# Altium project Apalis Evaluation Board.PrjPCB (part 1 of 5)
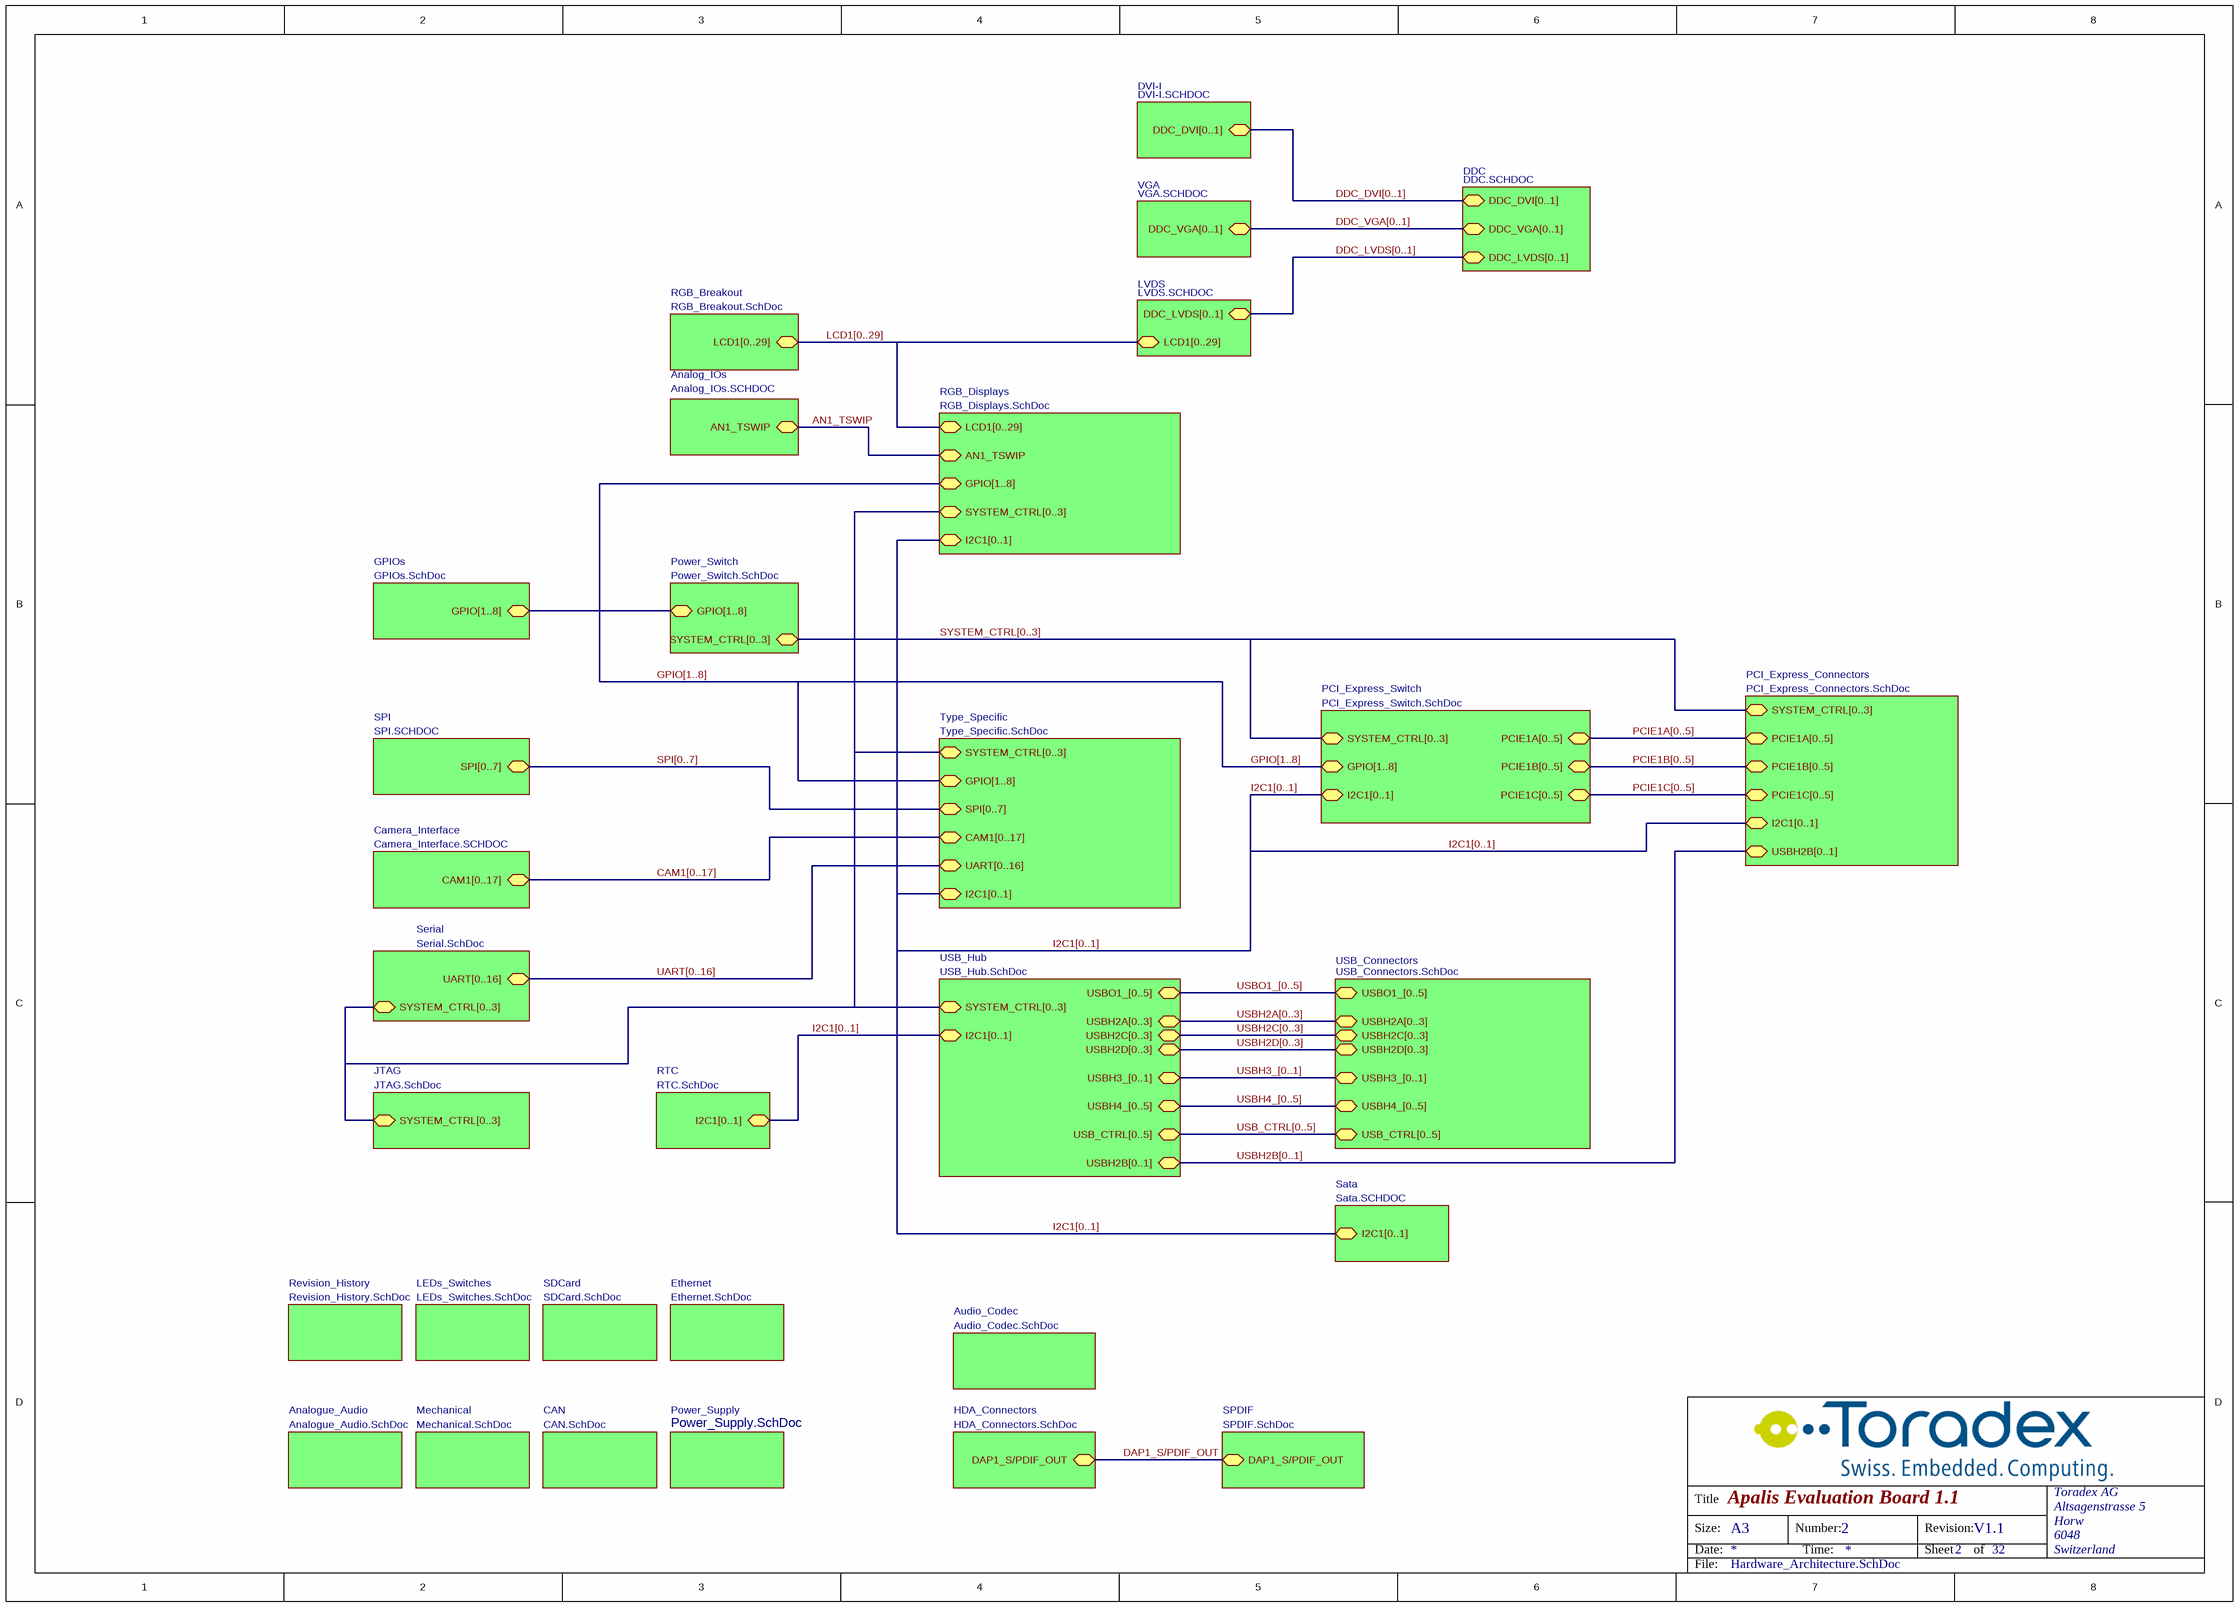
[diagram p0: Hardware_Architecture.SchDoc]
29 sheets, 1036 parts. Net scope: global (net labels, ports and power ports of the same name join across sheets).
Board file: Apalis Evaluation Board.PcbDoc
Sheets:
  Hardware_Architecture.SchDoc
    Analogue_Audio = Analogue_Audio.SchDoc
    Analog_IOs = Analog_IOs.SCHDOC
    Audio_Codec = Audio_Codec.SchDoc
    Camera_Interface = Camera_Interface.SCHDOC
    CAN = CAN.SchDoc
    Ethernet = Ethernet.SchDoc
    GPIOs = GPIOs.SchDoc
    HDA_Connectors = HDA_Connectors.SchDoc
    JTAG = JTAG.SchDoc
    LEDs_Switches = LEDs_Switches.SchDoc
    PCI_Express_Connectors = PCI_Express_Connectors.SchDoc
    PCI_Express_Switch = PCI_Express_Switch.SchDoc
    Power_Supply = Power_Supply.SchDoc
    Power_Switch = Power_Switch.SchDoc
    RGB_Displays = RGB_Displays.SchDoc
    RTC = RTC.SchDoc
    Sata = Sata.SCHDOC
    SPDIF = SPDIF.SchDoc
    SPI = SPI.SCHDOC
    Type_Specific = Type_Specific.SchDoc
    USB_Connectors = USB_Connectors.SchDoc
    USB_Hub = USB_Hub.SchDoc
    Mechanical = Mechanical.SchDoc
    DDC = DDC.SchDoc
    VGA = VGA.SchDoc
    LVDS = LVDS.SchDoc
    DVI-I = DVI-I.SchDoc
    Revision_History = Revision_History.SchDoc

## Sheet Hardware_Architecture.SchDoc: Apalis Evaluation Board 1.1
size A3; Organization: Toradex AG; Address1: Altsagenstrasse 5; Address2: Horw; Address3: 6048; Address4: Switzerland; DocumentNumber: 2; Revision: V1.1; SheetNumber: 2; SheetTotal: 32; PageSetup: Record=PageOptions|CenterHorizontal=True|CenterVertical=True|PrintScale=0.73|XCorrection=1.00|YCorrection=1.00|PrintKind=0|BorderSize=5000000|LeftOffset=0|BottomOffset=0|Orientation=2|PaperLength=1000|PaperWidth=1000|Scale=100|PaperSource=7|PrintQuality=600|MediaType=1|DitherType=10|PaperKind=A4|PrintScaleMode=1

### Sub-sheets
Analog_IOs = Analog_IOs.SCHDOC: AN1_TSWIP (bidir)
Analogue_Audio = Analogue_Audio.SchDoc: no entries
Audio_Codec = Audio_Codec.SchDoc: no entries
Camera_Interface = Camera_Interface.SCHDOC: CAM1[0..17] (bidir)
CAN = CAN.SchDoc: no entries
DDC = DDC.SCHDOC: DDC_VGA[0..1] (bidir), DDC_DVI[0..1] (bidir), DDC_LVDS[0..1] (bidir)
DVI-I = DVI-I.SCHDOC: DDC_DVI[0..1] (bidir)
Ethernet = Ethernet.SchDoc: no entries
GPIOs = GPIOs.SchDoc: GPIO[1..8] (bidir)
HDA_Connectors = HDA_Connectors.SchDoc: DAP1_S/PDIF_OUT (bidir)
JTAG = JTAG.SchDoc: SYSTEM_CTRL[0..3] (bidir)
LEDs_Switches = LEDs_Switches.SchDoc: no entries
LVDS = LVDS.SCHDOC: DDC_LVDS[0..1] (bidir), LCD1[0..29] (bidir)
Mechanical = Mechanical.SchDoc: no entries
PCI_Express_Connectors = PCI_Express_Connectors.SchDoc: PCIE1A[0..5] (bidir), PCIE1B[0..5] (bidir), PCIE1C[0..5] (bidir), I2C1[0..1] (bidir), USBH2B[0..1] (bidir), SYSTEM_CTRL[0..3] (bidir)
PCI_Express_Switch = PCI_Express_Switch.SchDoc: PCIE1A[0..5] (bidir), PCIE1B[0..5] (bidir), PCIE1C[0..5] (bidir), I2C1[0..1] (bidir), SYSTEM_CTRL[0..3] (bidir), GPIO[1..8] (bidir)
Power_Supply = Power_Supply.SchDoc: no entries
Power_Switch = Power_Switch.SchDoc: SYSTEM_CTRL[0..3] (bidir), GPIO[1..8] (bidir)
Revision_History = Revision_History.SchDoc: no entries
RGB_Breakout = RGB_Breakout.SchDoc (file not in this document): LCD1[0..29] (bidir)
RGB_Displays = RGB_Displays.SchDoc: LCD1[0..29] (bidir), AN1_TSWIP (bidir), SYSTEM_CTRL[0..3] (bidir), I2C1[0..1] (bidir), GPIO[1..8] (bidir)
RTC = RTC.SchDoc: I2C1[0..1] (bidir)
Sata = Sata.SCHDOC: I2C1[0..1] (bidir)
SDCard = SDCard.SchDoc (file not in this document): no entries
Serial = Serial.SchDoc (file not in this document): UART[0..16] (bidir), SYSTEM_CTRL[0..3] (bidir)
SPDIF = SPDIF.SchDoc: DAP1_S/PDIF_OUT (bidir)
SPI = SPI.SCHDOC: SPI[0..7] (bidir)
Type_Specific = Type_Specific.SchDoc: GPIO[1..8] (bidir), SPI[0..7] (bidir), SYSTEM_CTRL[0..3] (bidir), I2C1[0..1] (bidir), CAM1[0..17] (bidir), UART[0..16] (bidir)
USB_Connectors = USB_Connectors.SchDoc: USBO1_[0..5] (bidir), USBH4_[0..5] (bidir), USBH2D[0..3] (bidir), USBH2C[0..3] (bidir), USBH3_[0..1] (bidir), USB_CTRL[0..5] (bidir), USBH2A[0..3] (bidir)
USB_Hub = USB_Hub.SchDoc: I2C1[0..1] (bidir), USBH2A[0..3] (bidir), USBH2B[0..1] (bidir), USBH2C[0..3] (bidir), USBH2D[0..3] (bidir), USBO1_[0..5] (bidir), USBH4_[0..5] (bidir), USBH3_[0..1] (bidir), USB_CTRL[0..5] (bidir), SYSTEM_CTRL[0..3] (bidir)
VGA = VGA.SCHDOC: DDC_VGA[0..1] (bidir)

### Nets
AN1_TSWIP: sheet Analog_IOs/AN1_TSWIP, sheet RGB_Displays/AN1_TSWIP
DAP1_S/PDIF_OUT: sheet HDA_Connectors/DAP1_S/PDIF_OUT, sheet SPDIF/DAP1_S/PDIF_OUT

### Buses and harness runs
bus CAM1[0..17] = sheet Camera_Interface/CAM1[0..17] = sheet Type_Specific/CAM1[0..17]
bus DDC_DVI[0..1] = sheet DDC/DDC_DVI[0..1] = sheet DVI-I/DDC_DVI[0..1]
bus DDC_LVDS[0..1] = sheet DDC/DDC_LVDS[0..1] = sheet LVDS/DDC_LVDS[0..1]
bus DDC_VGA[0..1] = sheet DDC/DDC_VGA[0..1] = sheet VGA/DDC_VGA[0..1]
bus GPIO[1..8] = sheet GPIOs/GPIO[1..8] = sheet PCI_Express_Switch/GPIO[1..8] = sheet Power_Switch/GPIO[1..8] = sheet RGB_Displays/GPIO[1..8] = sheet Type_Specific/GPIO[1..8]
bus I2C1[0..1] = sheet PCI_Express_Connectors/I2C1[0..1] = sheet PCI_Express_Switch/I2C1[0..1] = sheet RGB_Displays/I2C1[0..1] = sheet RTC/I2C1[0..1] = sheet Sata/I2C1[0..1] = sheet Type_Specific/I2C1[0..1] = sheet USB_Hub/I2C1[0..1]
bus LCD1[0..29] = sheet LVDS/LCD1[0..29] = sheet RGB_Breakout/LCD1[0..29] = sheet RGB_Displays/LCD1[0..29]
bus PCIE1A[0..5] = sheet PCI_Express_Connectors/PCIE1A[0..5] = sheet PCI_Express_Switch/PCIE1A[0..5]
bus PCIE1B[0..5] = sheet PCI_Express_Connectors/PCIE1B[0..5] = sheet PCI_Express_Switch/PCIE1B[0..5]
bus PCIE1C[0..5] = sheet PCI_Express_Connectors/PCIE1C[0..5] = sheet PCI_Express_Switch/PCIE1C[0..5]
bus SPI[0..7] = sheet SPI/SPI[0..7] = sheet Type_Specific/SPI[0..7]
bus SYSTEM_CTRL[0..3] = sheet JTAG/SYSTEM_CTRL[0..3] = sheet PCI_Express_Connectors/SYSTEM_CTRL[0..3] = sheet PCI_Express_Switch/SYSTEM_CTRL[0..3] = sheet Power_Switch/SYSTEM_CTRL[0..3] = sheet RGB_Displays/SYSTEM_CTRL[0..3] = sheet Serial/SYSTEM_CTRL[0..3] = sheet Type_Specific/SYSTEM_CTRL[0..3] = sheet USB_Hub/SYSTEM_CTRL[0..3]
bus UART[0..16] = sheet Serial/UART[0..16] = sheet Type_Specific/UART[0..16]
bus USB_CTRL[0..5] = sheet USB_Connectors/USB_CTRL[0..5] = sheet USB_Hub/USB_CTRL[0..5]
bus USBH2A[0..3] = sheet USB_Connectors/USBH2A[0..3] = sheet USB_Hub/USBH2A[0..3]
bus USBH2B[0..1] = sheet PCI_Express_Connectors/USBH2B[0..1] = sheet USB_Hub/USBH2B[0..1]
bus USBH2C[0..3] = sheet USB_Connectors/USBH2C[0..3] = sheet USB_Hub/USBH2C[0..3]
bus USBH2D[0..3] = sheet USB_Connectors/USBH2D[0..3] = sheet USB_Hub/USBH2D[0..3]
bus USBH3_[0..1] = sheet USB_Connectors/USBH3_[0..1] = sheet USB_Hub/USBH3_[0..1]
bus USBH4_[0..5] = sheet USB_Connectors/USBH4_[0..5] = sheet USB_Hub/USBH4_[0..5]
bus USBO1_[0..5] = sheet USB_Connectors/USBO1_[0..5] = sheet USB_Hub/USBO1_[0..5]

### Notes on the sheet
- Title
- Size:
- Date:
- A3
- Number:
- Time:
- Revision:
- Sheet
- of
- File:

## Sheet Analogue_Audio.SchDoc: Apalis Evaluation Board 1.1
size A3; Organization: Toradex AG; Address1: Altsagenstrasse 5; Address2: Horw; Address3: 6048; Address4: Switzerland; DocumentNumber: 14; Revision: V1.1; SheetNumber: 14; SheetTotal: 32; PageSetup: Record=PageOptions|CenterHorizontal=True|CenterVertical=True|PrintScale=0.73|XCorrection=1.00|YCorrection=1.00|PrintKind=0|BorderSize=5000000|LeftOffset=0|BottomOffset=0|Orientation=2|PaperLength=1000|PaperWidth=1000|Scale=100|PaperSource=7|PrintQuality=-4|MediaType=1|DitherType=10|PaperKind=A4|PrintScaleMode=1
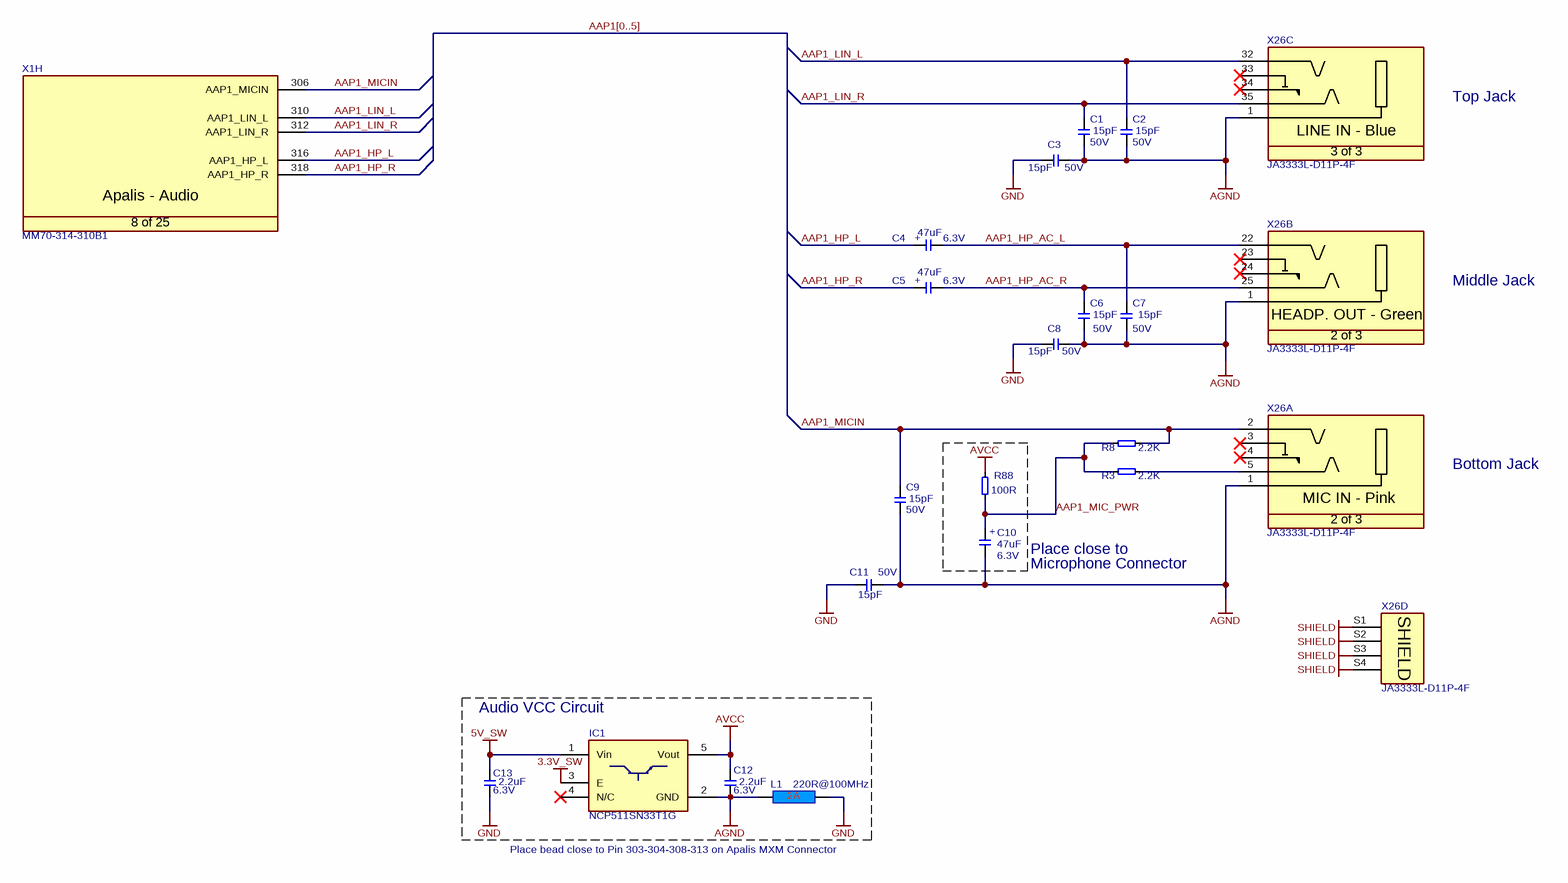
[diagram p1: Analogue_Audio.SchDoc]

### Parts
C1  Rating: 50V  [T_CAPC0603X33N]  (hidden comment: 15pF)
C2  Rating: 50V  [T_CAPC0603X33N]  (hidden comment: 15pF)
C3  Rating: 50V  [T_CAPC0603X33N]  (hidden comment: 15pF)
C4  Rating: 6.3V  [T_CAPMP3216X180N]  (hidden comment: 47uF)
C5  Rating: 6.3V  [T_CAPMP3216X180N]  (hidden comment: 47uF)
C6  Rating: 50V  [T_CAPC0603X33N]  (hidden comment: 15pF)
C7  Rating: 50V  [T_CAPC0603X33N]  (hidden comment: 15pF)
C8  Rating: 50V  [T_CAPC0603X33N]  (hidden comment: 15pF)
C9  Rating: 50V  [T_CAPC0603X33N]  (hidden comment: 15pF)
C10  Rating: 6.3V  [T_CAPMP3216X180N]  (hidden comment: 47uF)
C11  Rating: 50V  [T_CAPC0603X33N]  (hidden comment: 15pF)
C12  Rating: 6.3V  [T_CAPC0603X33N]  (hidden comment: 2.2uF)
C13  Rating: 6.3V  [T_CAPC0603X33N]  (hidden comment: 2.2uF)
IC1  NCP511SN33T1G  [SOT95P279X142-5N]
L1  220R@100MHz  [INDC1608X95N]
R3  2.2K  [T_RESC0603X30N]
R8  2.2K  [T_RESC0603X30N]
R88  100R  [T_RESC0603X30N]
X1  Manufacturer Part No.: MM70-314-310B1  [T_JAE_MM70-314-310B1]  (hidden comment: CON-JAE-MM70-314-310B1-314-0.5mm)  (part H of 25)
X26  JA3333L-D11P-4F  [T_FOXCONN_JA3333L-D11P-4F]  (parts A,B,C,D of 4)

### Blocks framed on the sheet
Audio VCC Circuit: C12 C13 IC1 L1

### Nets
3.3V_SW: IC1.3(E)
5V_SW: C13.2 IC1.1(Vin)
AGND: C1.1 C2.1 C3.2 C6.1 C7.1 C8.2 C9.1 C10.2 C11.1 C12.1 IC1.2(GND) L1.1 X26.1
AVCC: C12.2 IC1.5(Vout) R88.2
GND: C3.1 C8.1 C11.2 C13.1 L1.2
SHIELD: X26.S1(SHIELD) X26.S2(SHIELD) X26.S3(SHIELD) X26.S4(SHIELD)
AAP1_HP_AC_L: C4.2 C7.2 X26.22
AAP1_HP_AC_R: C5.2 C6.2 X26.25
AAP1_HP_L: C4.1 X1.316(AAP1_HP_L)
AAP1_HP_R: C5.1 X1.318(AAP1_HP_R)
AAP1_LIN_L: C2.2 X1.310(AAP1_LIN_L) X26.32
AAP1_LIN_R: C1.2 X1.312(AAP1_LIN_R) X26.35
AAP1_MIC_PWR: C10.1 R3.1 R8.1 R88.1
AAP1_MICIN: C9.2 R8.2 X1.306(AAP1_MICIN) X26.2
NetR3_2: R3.2 X26.5

Not connected (* = marked no-connect by the designer): IC1 4(N/C)*; X26 3* 4* 23* 24* 33* 34*

### Buses and harness runs
bus AAP1[0..5]

### Notes on the sheet
- Top Jack
- Middle Jack
- Bottom Jack
- Place close to
- (near C10) Microphone Connector
- Place bead close to Pin 303-304-308-313 on Apalis MXM Connector
- Title
- Size:
- Date:
- A3
- Number:
- Time:
- Revision:
- Sheet
- of
- File:
- (in symbol C-TA-47uF-6.3V-20%-3216) +
- (in symbol CON-Foxconn-JA3333L-D11P-4F, part A) MIC IN - Pink; 2 of 3
- (in symbol CON-Foxconn-JA3333L-D11P-4F, part B) HEADP. OUT - Green; 2 of 3
- (in symbol CON-Foxconn-JA3333L-D11P-4F, part C) LINE IN - Blue; 3 of 3
- (in symbol CON-JAE-MM70-314-310B1-314-0.5mm, part H) Apalis - Audio; 8 of 25

### Library data of the parts
C1-C3 C6-C9 C11 = C-NPO-15pF-50V-10%-0603: Capacitor Ceramic NPO 15pF 50V 10% 0603; Tolerance: 10%; Type: NPO; Value: 15pF
C4 C5 C10 = C-TA-47uF-6.3V-20%-3216: Capacitor TA 47uF 6.3V 20% 3216; Tolerance: 20%; Type: TA; Value: 47uF
C12 C13 = C-X5R-2.2uF-6.3V-20%-0603: Capacitor Ceramic X5R 2.2uF 6.3V 20% 0603; Tolerance: 20%; Type: X5R; Value: 2.2uF
IC1 = IC-ON-NCP511SN33T1G: NCP511SN33T1G LDO Regulator; Manufacturer Name: ON Semiconductor; Manufacturer Part No.: NCP511SN33T1G
L1 = L-220R@100MHz-2A-25%-0603: 220R@100MHz 2A EMI FILTER; Tolerance: 25%; Rating: 2A; Value: 220R@100MHz
R3 R8 = R-2.2KR-63mW-5%-0603: Resistor 2.2Kohm 63mW 5% 0603; Value: 2.2KR; Rating: 63mW; Tolerance: 5%
R88 = R-100R-63mW-5%-0603: Resistor 100 ohm 63mW 5% 0603; Rating: 63mW; Tolerance: 5%; Value: 100R
X1 = CON-JAE-MM70-314-310B1-314-0.5mm: MXM3 Connector; Manufacturer Name: JAE; No. of ways: 314
X26 = CON-Foxconn-JA3333L-D11P-4F: 3x Audiojack stereo, 3.5mm with sense; No. of ways: 13; Manufacturer Name: Foxconn; Manufacturer Part No.: JA3333L-D11P-4F

## Sheet Analog_IOs.SCHDOC: Apalis Evaluation Board 1.1
size A3; Organization: Toradex AG; Address1: Altsagenstrasse 5; Address2: Horw; Address3: 6048; Address4: Switzerland; DocumentNumber: 15; Revision: V1.1; SheetNumber: 15; SheetTotal: 32; PageSetup: Record=PageOptions|CenterHorizontal=True|CenterVertical=True|PrintScale=0.73|XCorrection=1.00|YCorrection=1.00|PrintKind=0|BorderSize=5000000|LeftOffset=0|BottomOffset=0|Orientation=2|PaperLength=1000|PaperWidth=1000|Scale=100|PaperSource=7|PrintQuality=-4|MediaType=1|DitherType=10|PaperKind=A4|PrintScaleMode=1
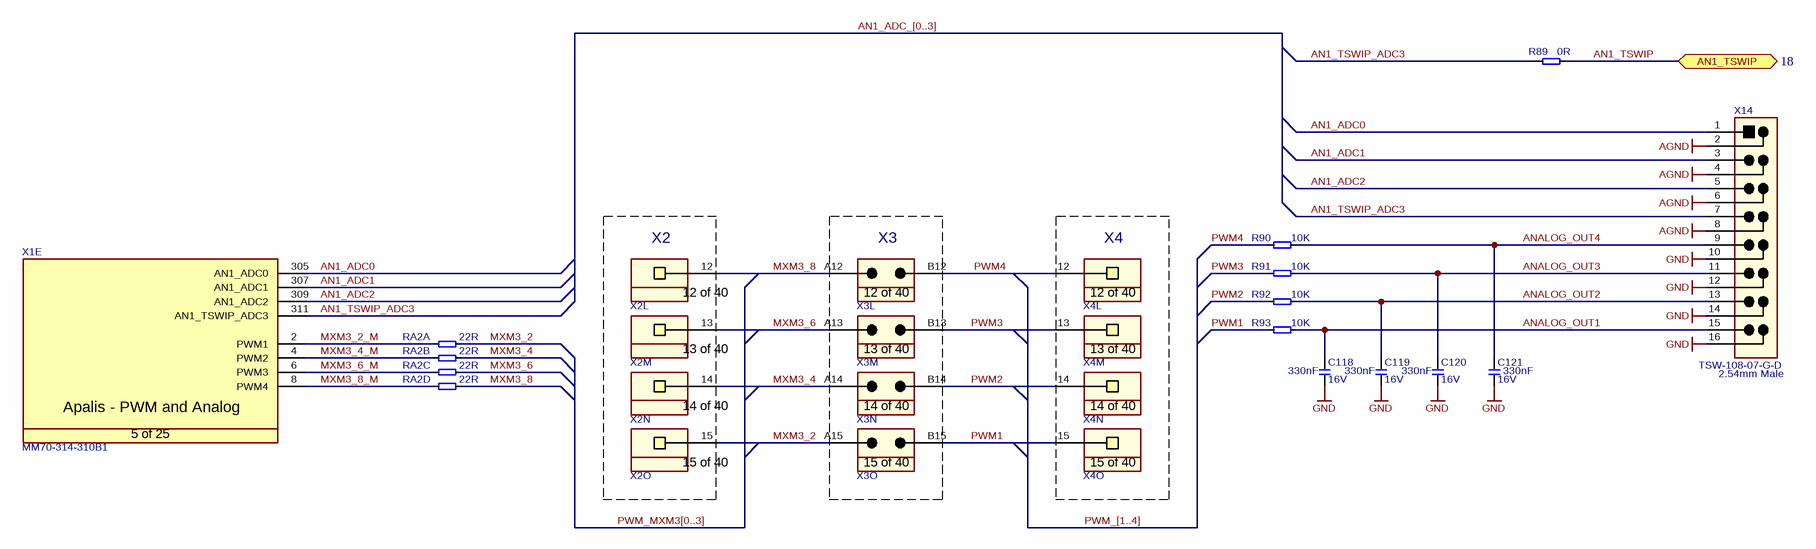
[diagram p2: Analog_IOs.SCHDOC]

### Parts
C118  Rating: 16V  [T_CAPC0805X125N]  (hidden comment: 330nF)
C119  Rating: 16V  [T_CAPC0805X125N]  (hidden comment: 330nF)
C120  Rating: 16V  [T_CAPC0805X125N]  (hidden comment: 330nF)
C121  Rating: 16V  [T_CAPC0805X125N]  (hidden comment: 330nF)
R89  0R  [T_RESC0603X30N]
R90  10K  [T_RESC0603X30N]
R91  10K  [T_RESC0603X30N]
R92  10K  [T_RESC0603X30N]
R93  10K  [T_RESC0603X30N]
RA2  22R  [T_Resistor_Array_X4]  (parts A,B,C,D of 4)
X1  Manufacturer Part No.: MM70-314-310B1  [T_JAE_MM70-314-310B1]  (hidden comment: CON-JAE-MM70-314-310B1-314-0.5mm)  (part E of 25)
X2  SSW-110-01-G-S  [T_Samtec_SSW-110-01-G-S]  (value not drawn)  (parts L,M,N,O of 40)
X3  TSW-110-07-G-D  [T_Samtec_TSW-110-07-G-D]  (value not drawn)  (parts L,M,N,O of 40)
X4  SSW-110-01-G-S  [T_Samtec_SSW-110-01-G-S]  (value not drawn)  (parts L,M,N,O of 40)
X14  TSW-108-07-G-D  [T_Samtec_TSW-108-07-G-D]

### Blocks framed on the sheet
X2: X2
X3: X3
X4: X4

### Ports
AN1_TSWIP (bidir, see 18)

### Nets
AGND: X14.2 X14.4 X14.6 X14.8
GND: C118.1 C119.1 C120.1 C121.1 X14.10 X14.12 X14.14 X14.16
AN1_ADC0: X1.305(AN1_ADC0) X14.1
AN1_ADC1: X1.307(AN1_ADC1) X14.3
AN1_ADC2: X1.309(AN1_ADC2) X14.5
AN1_TSWIP: R89.2 ; port AN1_TSWIP
AN1_TSWIP_ADC3: R89.1 X1.311(AN1_TSWIP_ADC3) X14.7
ANALOG_OUT1: C118.2 R93.2 X14.15
ANALOG_OUT2: C119.2 R92.2 X14.13
ANALOG_OUT3: C120.2 R91.2 X14.11
ANALOG_OUT4: C121.2 R90.2 X14.9
MXM3_2: RA2.1 X2.15 X3.A15
MXM3_2_M: RA2.5 X1.2(PWM1)
MXM3_4: RA2.2 X2.14 X3.A14
MXM3_4_M: RA2.6 X1.4(PWM2)
MXM3_6: RA2.3 X2.13 X3.A13
MXM3_6_M: RA2.7 X1.6(PWM3)
MXM3_8: RA2.4 X2.12 X3.A12
MXM3_8_M: RA2.8 X1.8(PWM4)
PWM1: R93.1 X3.B15 X4.15
PWM2: R92.1 X3.B14 X4.14
PWM3: R91.1 X3.B13 X4.13
PWM4: R90.1 X3.B12 X4.12

### Buses and harness runs
bus AN1_ADC_[0..3]
bus PWM_[1..4]
bus PWM_MXM3[0..3]

### Notes on the sheet
- (near X14) 2.54mm Male
- Title
- Size:
- Date:
- A3
- Number:
- Time:
- Revision:
- Sheet
- of
- File:
- (in symbol CON-JAE-MM70-314-310B1-314-0.5mm, part E) Apalis - PWM and Analog; 5 of 25
- (in symbol CON-Samtec-SSW-110-01-G-S, part L) 12 of 40
- (in symbol CON-Samtec-SSW-110-01-G-S, part M) 13 of 40
- (in symbol CON-Samtec-SSW-110-01-G-S, part N) 14 of 40
- (in symbol CON-Samtec-SSW-110-01-G-S, part O) 15 of 40
- (in symbol CON-Samtec-TSW-110-07-G-D, part L) 12 of 40
- (in symbol CON-Samtec-TSW-110-07-G-D, part M) 13 of 40
- (in symbol CON-Samtec-TSW-110-07-G-D, part N) 14 of 40
- (in symbol CON-Samtec-TSW-110-07-G-D, part O) 15 of 40

### Library data of the parts
C118-C121 = C-X7R-330nF-16V-10%-0805: Capacitor Ceramic X7R 330nF 16V 10% 0805; Tolerance: 10%; Type: X7R; Value: 330nF
R89 = R-0R-63mW-1%-0603: Resistor 0 ohm 63mW 1% 0603; Rating: 63mW; Tolerance: 1%; Value: 0R
R90-R93 = R-10KR-63mW-5%-0603: Resistor 10 Kohm 63mW 5% 0603; Value: 10KR; Rating: 63mW; Tolerance: 5%
RA2 = RA-22R-63mW-5%-1206-div: Resistor Array 22 R 63mW 5% 1206; Tolerance: 5%; Power Dissipation: 63mW; Value: 22R
X1 = CON-JAE-MM70-314-310B1-314-0.5mm: as X1 on sheet Analogue_Audio
X2 X4 = CON-Samtec-SSW-110-01-G-S: Receptacle Female Socket 1x40 pin 2.54mm pitch; Manufacturer Name: Samtec; Pitch: 2.54mm; No. of ways: 1x40; Manufacturer Part No.: SSW-110-01-G-S
X3 = CON-Samtec-TSW-110-07-G-D: Header 2x40 pin 2.54mm pitch; Manufacturer Name: Samtec; Pitch: 2.54mm; No. of ways: 2x40; Manufacturer Part No.: TSW-110-07-G-D
X14 = CON-Samtec-TSW-108-07-G-D: Header Male, 2x8 Pins, 2.54mm pitch; Manufacturer Name: Samtec; No. of ways: 2x8; Pitch: 2.54mm; Manufacturer Part No.: TSW-108-07-G-D

## Sheet Audio_Codec.SchDoc: Apalis Evaluation Board 1.1
size A3; Organization: Toradex AG; Address1: Altsagenstrasse 5; Address2: Horw; Address3: 6048; Address4: Switzerland; DocumentNumber: 11; Revision: V1.1; SheetNumber: 11; SheetTotal: 32; PageSetup: Record=PageOptions|CenterHorizontal=True|CenterVertical=True|PrintScale=0.73|XCorrection=1.00|YCorrection=1.00|PrintKind=0|BorderSize=5000000|LeftOffset=0|BottomOffset=0|Orientation=2|PaperLength=1000|PaperWidth=1000|Scale=100|PaperSource=7|PrintQuality=-4|MediaType=1|DitherType=10|PaperKind=A4|PrintScaleMode=1
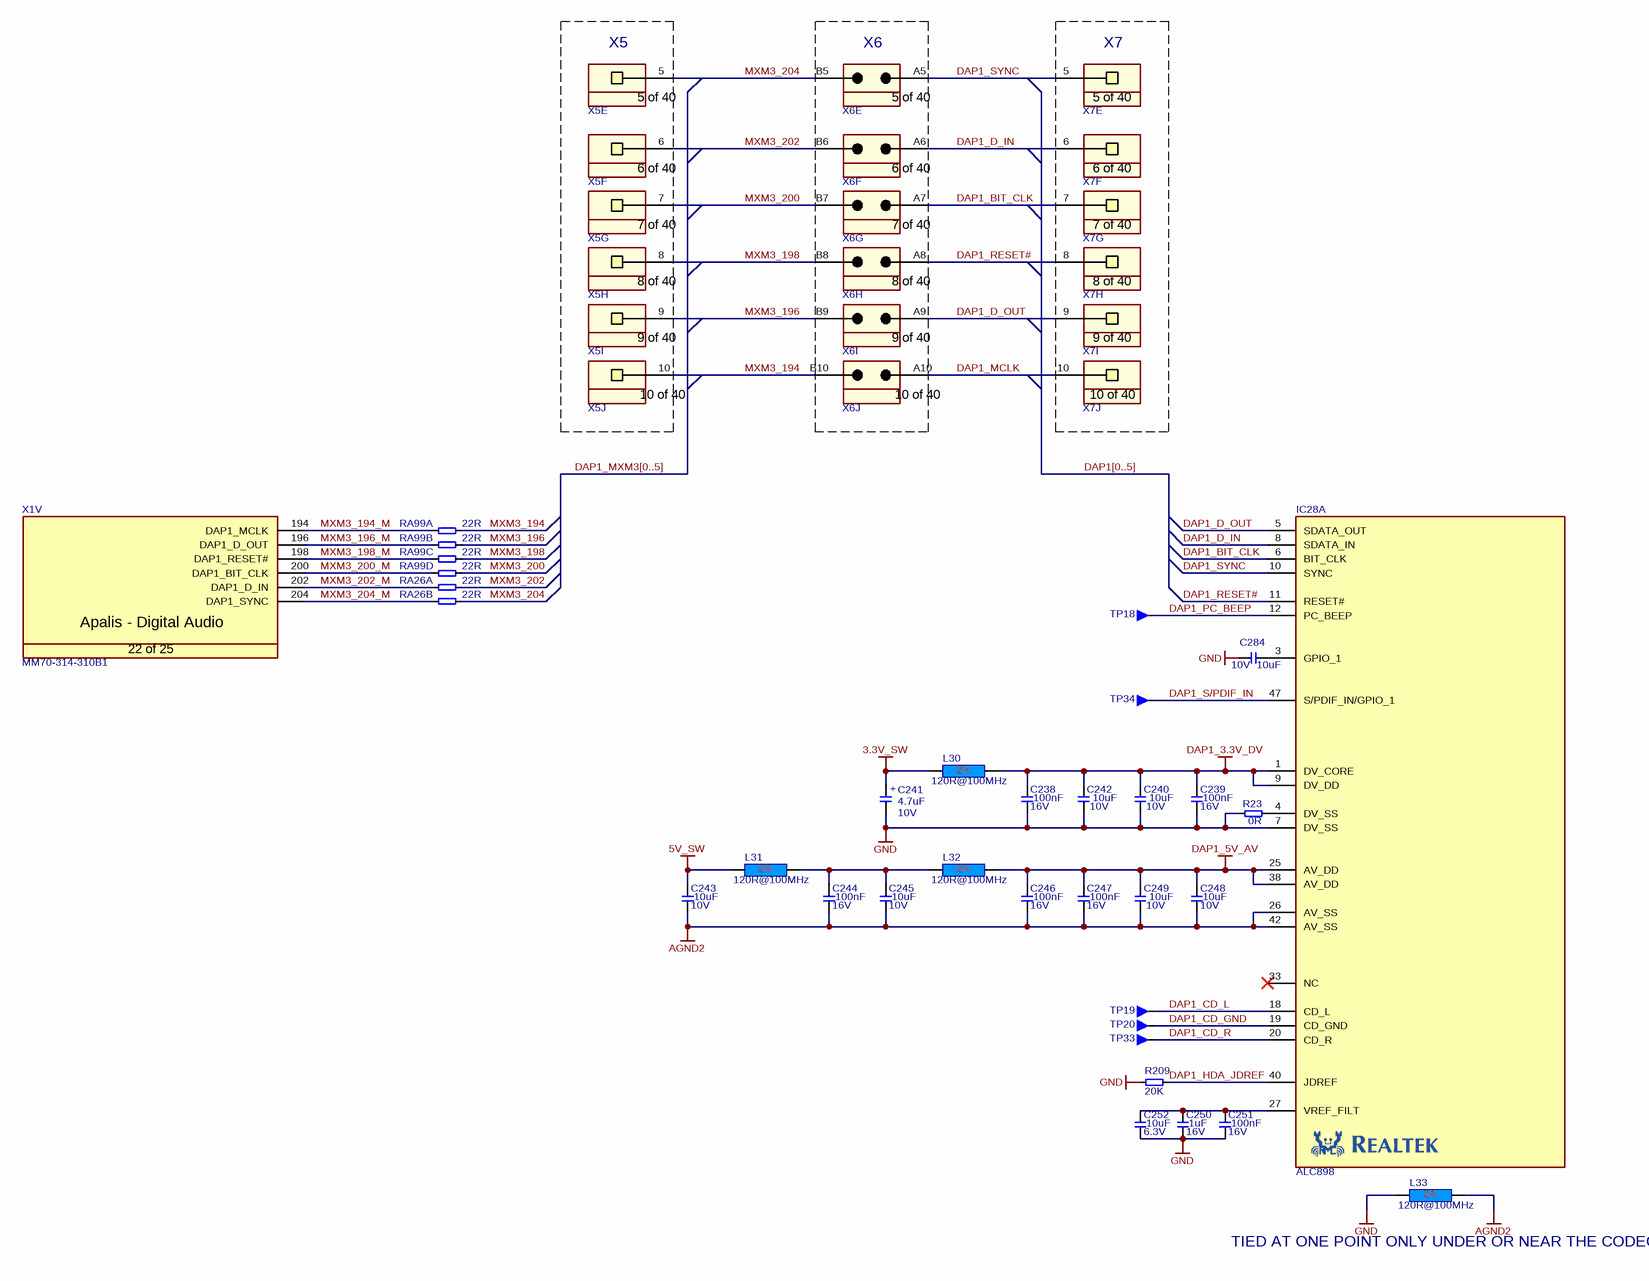
[diagram p3: Audio_Codec.SchDoc]

### Parts
C238  Rating: 16V  [CAPC1005X60N]  (hidden comment: 100nF)
C239  Rating: 16V  [CAPC1005X60N]  (hidden comment: 100nF)
C240  Rating: 10V  [T_CAPC0603X33N]  (hidden comment: 10uF)
C241  Rating: 10V  [T_CAPMP3216X180N]  (hidden comment: 4.7uF)
C242  Rating: 10V  [T_CAPC0603X33N]  (hidden comment: 10uF)
C243  Rating: 10V  [T_CAPC0603X33N]  (hidden comment: 10uF)
C244  Rating: 16V  [CAPC1005X60N]  (hidden comment: 100nF)
C245  Rating: 10V  [T_CAPC0603X33N]  (hidden comment: 10uF)
C246  Rating: 16V  [CAPC1005X60N]  (hidden comment: 100nF)
C247  Rating: 16V  [CAPC1005X60N]  (hidden comment: 100nF)
C248  Rating: 10V  [T_CAPC0603X33N]  (hidden comment: 10uF)
C249  Rating: 10V  [T_CAPC0603X33N]  (hidden comment: 10uF)
C250  Rating: 16V  [CAPC1005X60N]  (hidden comment: 1uF)
C251  Rating: 16V  [CAPC1005X60N]  (hidden comment: 100nF)
C252  Rating: 6.3V  [T_CAPC0603X33N]  (hidden comment: 10uF)
C284  Rating: 10V  [T_CAPC0603X33N]  (hidden comment: 10uF)
IC28  ALC898  [TSQFP50P900X900X160-48N]  (part A of 2)
L30  120R@100MHz  [INDC1608X95N]
L31  120R@100MHz  [INDC1608X95N]
L32  120R@100MHz  [INDC1608X95N]
L33  120R@100MHz  [INDC1608X95N]
R23  0R  [RESC1005X40N]
R209  20K  [T_RESC0603X30N]
RA26  22R  [T_Resistor_Array_X4]  (parts A,B of 4)
RA99  22R  [T_Resistor_Array_X4]  (parts A,B,C,D of 4)
TP18  Testpin  [T_TP-THT]  (value not drawn)
TP19  Testpin  [T_TP-THT]  (value not drawn)
TP20  Testpin  [T_TP-THT]  (value not drawn)
TP33  Testpin  [T_TP-THT]  (value not drawn)
TP34  Testpin  [T_TP-THT]  (value not drawn)
X1  Manufacturer Part No.: MM70-314-310B1  [T_JAE_MM70-314-310B1]  (hidden comment: CON-JAE-MM70-314-310B1-314-0.5mm)  (part V of 25)
X5  SSW-110-01-G-S  [T_Samtec_SSW-110-01-G-S]  (value not drawn)  (parts E,F,G,H,I,J of 40)
X6  TSW-110-07-G-D  [T_Samtec_TSW-110-07-G-D]  (value not drawn)  (parts E,F,G,H,I,J of 40)
X7  SSW-110-01-G-S  [T_Samtec_SSW-110-01-G-S]  (value not drawn)  (parts E,F,G,H,I,J of 40)

### Blocks framed on the sheet
X5: X5
X6: X6
X7: X7

### Nets
3.3V_SW: C241.1 L30.1
5V_SW: C243.2 L31.1
AGND2: C243.1 C244.1 C245.1 C246.1 C247.1 C248.1 C249.1 IC28.26(AV_SS) IC28.42(AV_SS) L33.2
DAP1_3.3V_DV: C238.2 C239.2 C240.2 C242.2 IC28.1(DV_CORE) IC28.9(DV_DD) L30.2
DAP1_5V_AV: C246.2 C247.2 C248.2 C249.2 IC28.25(AV_DD) IC28.38(AV_DD) L32.2
GND: C238.1 C239.1 C240.1 C241.2 C242.1 C250.1 C251.1 C252.1 C284.2 IC28.7(DV_SS) L33.1 R23.1 R209.1
DAP1_BIT_CLK: IC28.6(BIT_CLK) X6.A7 X7.7
DAP1_CD_GND: IC28.19(CD_GND) TP20.1
DAP1_CD_L: IC28.18(CD_L) TP19.1
DAP1_CD_R: IC28.20(CD_R) TP33.1
DAP1_D_IN: IC28.8(SDATA_IN) X6.A6 X7.6
DAP1_D_OUT: IC28.5(SDATA_OUT) X6.A9 X7.9
DAP1_HDA_JDREF: IC28.40(JDREF) R209.2
DAP1_MCLK: X6.A10 X7.10
DAP1_PC_BEEP: IC28.12(PC_BEEP) TP18.1
DAP1_RESET#: IC28.11(RESET#) X6.A8 X7.8
DAP1_S/PDIF_IN: IC28.47(S/PDIF_IN/GPIO_1) TP34.1
DAP1_SYNC: IC28.10(SYNC) X6.A5 X7.5
MXM3_194: RA99.5 X5.10 X6.B10
MXM3_194_M: RA99.1 X1.194(DAP1_MCLK)
MXM3_196: RA99.6 X5.9 X6.B9
MXM3_196_M: RA99.2 X1.196(DAP1_D_OUT)
MXM3_198: RA99.7 X5.8 X6.B8
MXM3_198_M: RA99.3 X1.198(DAP1_RESET#)
MXM3_200: RA99.8 X5.7 X6.B7
MXM3_200_M: RA99.4 X1.200(DAP1_BIT_CLK)
MXM3_202: RA26.5 X5.6 X6.B6
MXM3_202_M: RA26.1 X1.202(DAP1_D_IN)
MXM3_204: RA26.6 X5.5 X6.B5
MXM3_204_M: RA26.2 X1.204(DAP1_SYNC)
NetC244_2: C244.2 C245.2 L31.2 L32.1
NetC250_2: C250.2 C251.2 C252.2 IC28.27(VREF_FILT)
NetC284_1: C284.1 IC28.3(GPIO_1)
NetIC28_4: IC28.4(DV_SS) R23.2

Not connected (* = marked no-connect by the designer): IC28 33(NC)*

### Buses and harness runs
bus DAP1[0..5]
bus DAP1_MXM3[0..5]

### Notes on the sheet
- (near L33) TIED AT ONE POINT ONLY UNDER OR NEAR THE CODEC
- Title
- Size:
- Date:
- A3
- Number:
- Time:
- Revision:
- Sheet
- of
- File:
- (in symbol C-TA-4.7uF-10V-20%-3216) +
- (in symbol CON-JAE-MM70-314-310B1-314-0.5mm, part V) Apalis - Digital Audio; 22 of 25
- (in symbol CON-Samtec-SSW-110-01-G-S, part E) 5 of 40
- (in symbol CON-Samtec-SSW-110-01-G-S, part F) 6 of 40
- (in symbol CON-Samtec-SSW-110-01-G-S, part G) 7 of 40
- (in symbol CON-Samtec-SSW-110-01-G-S, part H) 8 of 40
- (in symbol CON-Samtec-SSW-110-01-G-S, part I) 9 of 40
- (in symbol CON-Samtec-SSW-110-01-G-S, part J) 10 of 40
- (in symbol CON-Samtec-TSW-110-07-G-D, part E) 5 of 40
- (in symbol CON-Samtec-TSW-110-07-G-D, part F) 6 of 40
- (in symbol CON-Samtec-TSW-110-07-G-D, part G) 7 of 40
- (in symbol CON-Samtec-TSW-110-07-G-D, part H) 8 of 40
- (in symbol CON-Samtec-TSW-110-07-G-D, part I) 9 of 40
- (in symbol CON-Samtec-TSW-110-07-G-D, part J) 10 of 40

### Library data of the parts
C238 C239 C244 C246 C247 C251 = C-X7R-100nF-16V-10%-0402: Capacitor Ceramic X7R 100nF 16V 10% 0402; Tolerance: 10%; Type: X7R; Value: 100nF
C240 C242 C243 C245 C248 C249 C284 = C-X5R-10uF-10V-20%-0603: Capacitor Ceramic X5R 10uF 10V 20% 0603; Tolerance: 20%; Type: X5R; Value: 10uF
C241 = C-TA-4.7uF-10V-20%-3216: Capacitor TA 4.7uF 10V 20% 3216; Tolerance: 20%; Type: TA; Value: 4.7uF
C250 = C-X5R-1uF-16V-10%-0402: Capacitor Ceramic X5R 1uF 16V 10% 0402; Tolerance: 10%; Type: X5R; Value: 1uF
C252 = C-X5R-10uF-6.3V-20%-0603: Capacitor Ceramic X5R 10uF 6.3V 20% 0603; Tolerance: 20%; Type: X5R; Value: 10uF
IC28 = IC-Realtek-ALC898: HD_AUDIO_CODEC; Manufacturer Part No.: ALC898; Manufacturer Name: Realtek
L30-L33 = L-120R@100MHz-2A-25%-0603: 120R@100MHz 2A EMI FILTER; Tolerance: 25%; Rating: 2A; Value: 120R@100MHz
R23 = R-0R-63mW-1%-0402: Resistor 0 ohm 63mW 1% 0402; Rating: 63mW; Tolerance: 1%; Value: 0R
R209 = R-20KR-63mW-1%-0603: Resistor 20 Kohm 63mW 1% 0603; Value: 20KR; Rating: 63mW; Tolerance: 1%
RA26 RA99 = RA-22R-63mW-5%-1206-div: Resistor Array 22 R 63mW 5% 1206; Tolerance: 5%; Power Dissipation: 63mW; Value: 22R
TP18-TP20 TP33 TP34 = Testpin: Testpin TH
X1 = CON-JAE-MM70-314-310B1-314-0.5mm: as X1 on sheet Analogue_Audio
X5 X7 = CON-Samtec-SSW-110-01-G-S: as X2 on sheet Analog_IOs; Pitch: 2.54mm; No. of ways: 1x40; Manufacturer Part No.: SSW-110-01-G-S
X6 = CON-Samtec-TSW-110-07-G-D: as X3 on sheet Analog_IOs; Pitch: 2.54mm; No. of ways: 2x40; Manufacturer Part No.: TSW-110-07-G-D

## Sheet Camera_Interface.SCHDOC: Apalis Evaluation Board 1.1
size A3; Organization: Toradex AG; Address1: Altsagenstrasse 5; Address2: Horw; Address3: 6048; Address4: Switzerland; DocumentNumber: 16; Revision: V1.1; SheetNumber: 16; SheetTotal: 32; PageSetup: Record=PageOptions|CenterHorizontal=True|CenterVertical=True|PrintScale=0.73|XCorrection=1.00|YCorrection=1.00|PrintKind=0|BorderSize=5000000|LeftOffset=0|BottomOffset=0|Orientation=2|PaperLength=1000|PaperWidth=1000|Scale=100|PaperSource=7|PrintQuality=-4|MediaType=1|DitherType=10|PaperKind=A4|PrintScaleMode=1
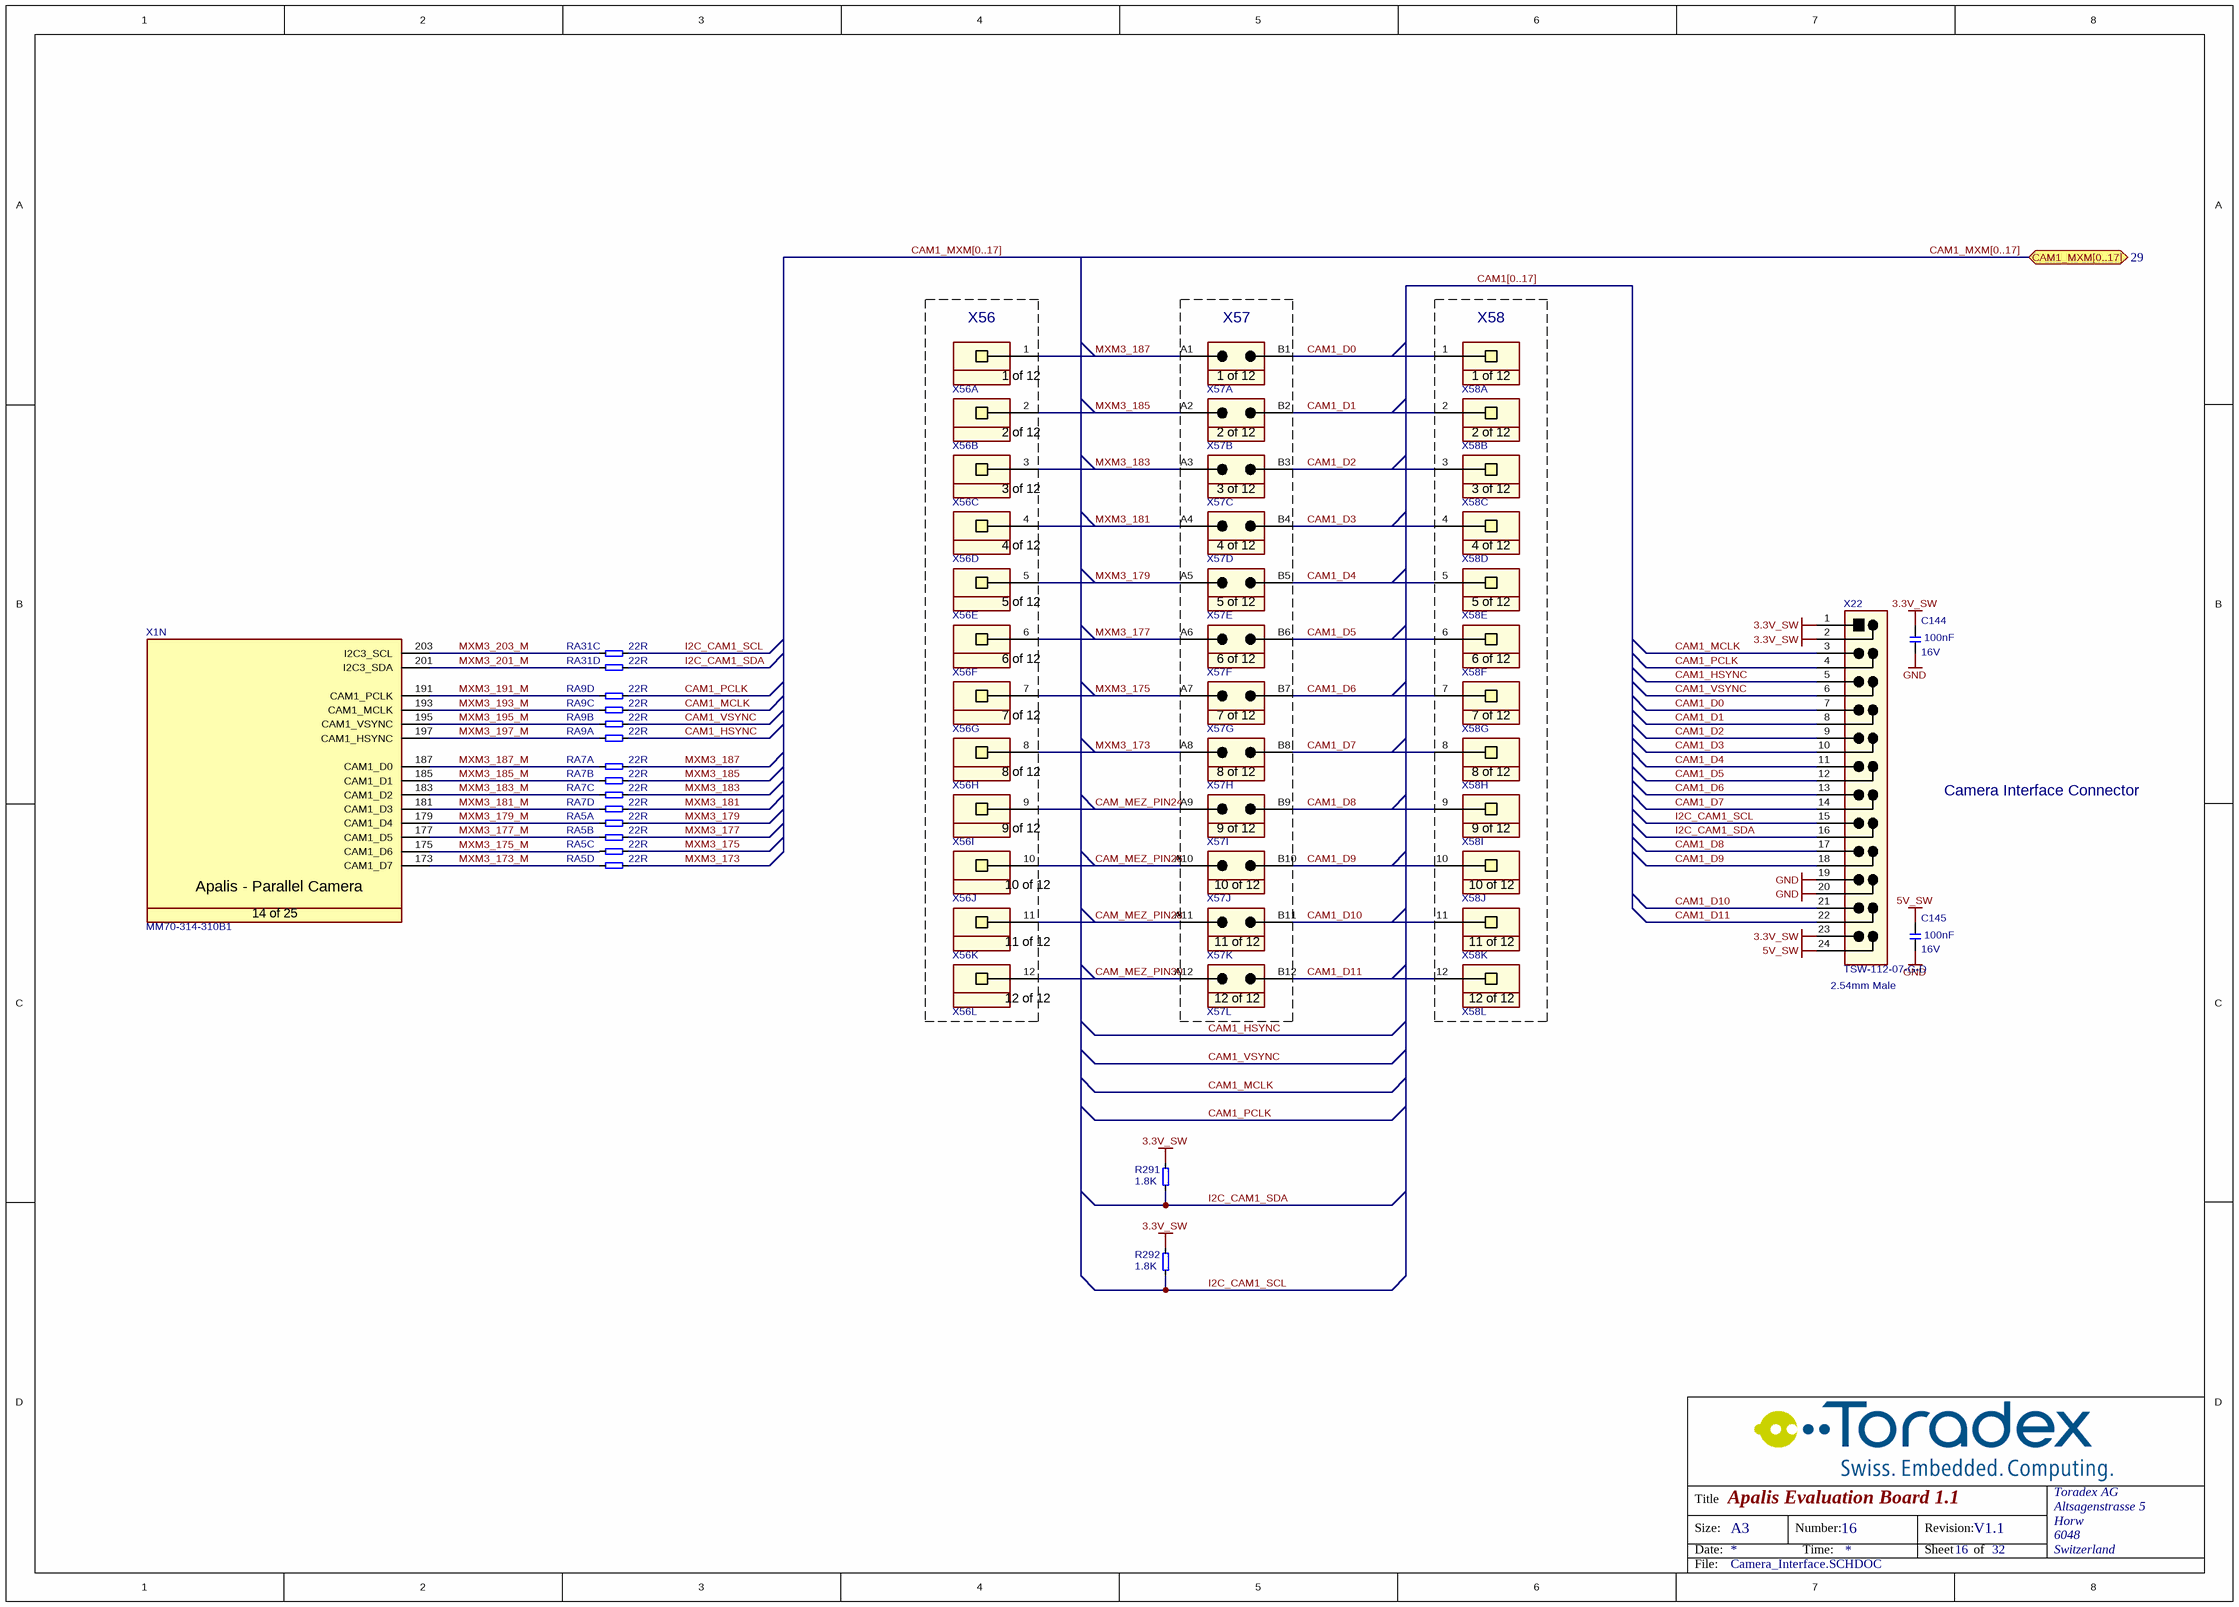
[diagram p4: Camera_Interface.SCHDOC]

### Parts
C144  Rating: 16V  [T_CAPC0603X33N]  (hidden comment: 100nF)
C145  Rating: 16V  [T_CAPC0603X33N]  (hidden comment: 100nF)
R291  1.8K  [T_RESC0603X30N]
R292  1.8K  [T_RESC0603X30N]
RA5  22R  [T_Resistor_Array_X4]  (parts A,B,C,D of 4)
RA7  22R  [T_Resistor_Array_X4]  (parts A,B,C,D of 4)
RA9  22R  [T_Resistor_Array_X4]  (parts A,B,C,D of 4)
RA31  22R  [T_Resistor_Array_X4]  (parts C,D of 4)
X1  Manufacturer Part No.: MM70-314-310B1  [T_JAE_MM70-314-310B1]  (hidden comment: CON-JAE-MM70-314-310B1-314-0.5mm)  (part N of 25)
X22  TSW-112-07-G-D  [T_Samtec_TSW-112-07-G-D-HEADER]
X56  SSW-112-01-G-S  [T_Samtec_SSW-112-01-G-S]  (value not drawn)  (parts A,B,C,D,E,F,G,H,I,J,K,L of 12)
X57  TSW-112-07-G-D  [T_Samtec_TSW-112-07-G-D]  (value not drawn)  (parts A,B,C,D,E,F,G,H,I,J,K,L of 12)
X58  SSW-112-01-G-S  [T_Samtec_SSW-112-01-G-S]  (value not drawn)  (parts A,B,C,D,E,F,G,H,I,J,K,L of 12)

### Blocks framed on the sheet
X56: X56
X57: X57
X58: X58

### Ports
CAM1_MXM[0..17] (bidir, see 29)

### Nets
3.3V_SW: C144.2 R291.1 R292.1 X22.1 X22.2 X22.23
5V_SW: C145.2 X22.24
GND: C144.1 C145.1 X22.19 X22.20
CAM1_D0: X22.7 X57.B1 X58.1
CAM1_D1: X22.8 X57.B2 X58.2
CAM1_D2: X22.9 X57.B3 X58.3
CAM1_D3: X22.10 X57.B4 X58.4
CAM1_D4: X22.11 X57.B5 X58.5
CAM1_D5: X22.12 X57.B6 X58.6
CAM1_D6: X22.13 X57.B7 X58.7
CAM1_D7: X22.14 X57.B8 X58.8
CAM1_D8: X22.17 X57.B9 X58.9
CAM1_D9: X22.18 X57.B10 X58.10
CAM1_D10: X22.21 X57.B11 X58.11
CAM1_D11: X22.22 X57.B12 X58.12
CAM1_HSYNC: RA9.5 X22.5
CAM1_MCLK: RA9.7 X22.3
CAM1_PCLK: RA9.8 X22.4
CAM1_VSYNC: RA9.6 X22.6
CAM_MEZ_PIN24: X56.9 X57.A9
CAM_MEZ_PIN26: X56.10 X57.A10
CAM_MEZ_PIN28: X56.11 X57.A11
CAM_MEZ_PIN30: X56.12 X57.A12
I2C_CAM1_SCL: R292.2 RA31.7 X22.15
I2C_CAM1_SDA: R291.2 RA31.8 X22.16
MXM3_173: RA5.8 X56.8 X57.A8
MXM3_173_M: RA5.4 X1.173(CAM1_D7)
MXM3_175: RA5.7 X56.7 X57.A7
MXM3_175_M: RA5.3 X1.175(CAM1_D6)
MXM3_177: RA5.6 X56.6 X57.A6
MXM3_177_M: RA5.2 X1.177(CAM1_D5)
MXM3_179: RA5.5 X56.5 X57.A5
MXM3_179_M: RA5.1 X1.179(CAM1_D4)
MXM3_181: RA7.8 X56.4 X57.A4
MXM3_181_M: RA7.4 X1.181(CAM1_D3)
MXM3_183: RA7.7 X56.3 X57.A3
MXM3_183_M: RA7.3 X1.183(CAM1_D2)
MXM3_185: RA7.6 X56.2 X57.A2
MXM3_185_M: RA7.2 X1.185(CAM1_D1)
MXM3_187: RA7.5 X56.1 X57.A1
MXM3_187_M: RA7.1 X1.187(CAM1_D0)
MXM3_191_M: RA9.4 X1.191(CAM1_PCLK)
MXM3_193_M: RA9.3 X1.193(CAM1_MCLK)
MXM3_195_M: RA9.2 X1.195(CAM1_VSYNC)
MXM3_197_M: RA9.1 X1.197(CAM1_HSYNC)
MXM3_201_M: RA31.4 X1.201(I2C3_SDA)
MXM3_203_M: RA31.3 X1.203(I2C3_SCL)

### Buses and harness runs
bus CAM1[0..17]
bus CAM1_MXM[0..17] = port CAM1_MXM[0..17]

### Notes on the sheet
- Camera Interface Connector
- (near X22) 2.54mm Male
- Title
- Size:
- Date:
- A3
- Number:
- Time:
- Revision:
- Sheet
- of
- File:
- (in symbol CON-JAE-MM70-314-310B1-314-0.5mm, part N) Apalis - Parallel Camera; 14 of 25
- (in symbol CON-Samtec-SSW-112-01-G-S, part A) 1 of 12
- (in symbol CON-Samtec-SSW-112-01-G-S, part B) 2 of 12
- (in symbol CON-Samtec-SSW-112-01-G-S, part C) 3 of 12
- (in symbol CON-Samtec-SSW-112-01-G-S, part D) 4 of 12
- (in symbol CON-Samtec-SSW-112-01-G-S, part E) 5 of 12
- (in symbol CON-Samtec-SSW-112-01-G-S, part F) 6 of 12
- (in symbol CON-Samtec-SSW-112-01-G-S, part G) 7 of 12
- (in symbol CON-Samtec-SSW-112-01-G-S, part H) 8 of 12
- (in symbol CON-Samtec-SSW-112-01-G-S, part I) 9 of 12
- (in symbol CON-Samtec-SSW-112-01-G-S, part J) 10 of 12
- (in symbol CON-Samtec-SSW-112-01-G-S, part K) 11 of 12
- (in symbol CON-Samtec-SSW-112-01-G-S, part L) 12 of 12
- (in symbol CON-Samtec-TSW-112-07-G-D, part A) 1 of 12
- (in symbol CON-Samtec-TSW-112-07-G-D, part B) 2 of 12
- (in symbol CON-Samtec-TSW-112-07-G-D, part C) 3 of 12
- (in symbol CON-Samtec-TSW-112-07-G-D, part D) 4 of 12
- (in symbol CON-Samtec-TSW-112-07-G-D, part E) 5 of 12
- (in symbol CON-Samtec-TSW-112-07-G-D, part F) 6 of 12
- (in symbol CON-Samtec-TSW-112-07-G-D, part G) 7 of 12
- (in symbol CON-Samtec-TSW-112-07-G-D, part H) 8 of 12
- (in symbol CON-Samtec-TSW-112-07-G-D, part I) 9 of 12
- (in symbol CON-Samtec-TSW-112-07-G-D, part J) 10 of 12
- (in symbol CON-Samtec-TSW-112-07-G-D, part K) 11 of 12
- (in symbol CON-Samtec-TSW-112-07-G-D, part L) 12 of 12

### Library data of the parts
C144 C145 = C-X7R-100nF-16V-10%-0603: Capacitor Ceramic X7R 100nF 16V 10% 0603; Tolerance: 10%; Type: X7R; Value: 100nF
R291 R292 = R-1.8KR-63mW-5%-0603: Resistor 1.8 Kohm 63mW 5% 0603; Value: 1.8KR; Rating: 63mW; Tolerance: 5%
RA5 RA7 RA9 RA31 = RA-22R-63mW-5%-1206-div: Resistor Array 22 R 63mW 5% 1206; Tolerance: 5%; Power Dissipation: 63mW
  RA5 RA7 RA31: Value: 22R
X1 = CON-JAE-MM70-314-310B1-314-0.5mm: as X1 on sheet Analogue_Audio
X22 = CON-Samtec-TSW-112-07-G-D-Header: Header male, 2x12 Pins, 2.54 mm pitch; Manufacturer Name: Samtec; Pitch: 2.54 mm; No. of ways: 2x12; Manufacturer Part No.: TSW-112-07-G-D
X56 X58 = CON-Samtec-SSW-112-01-G-S: Header 1x12 pin 2.54mm pitch; Manufacturer Name: Samtec; Pitch: 2.54mm; No. of ways: 1x12; Manufacturer Part No.: SSW-112-01-G-S
X57 = CON-Samtec-TSW-112-07-G-D: Header 2x12 pin 2.54mm pitch; Manufacturer Name: Samtec; Pitch: 2.54mm; No. of ways: 2x12; Manufacturer Part No.: TSW-112-07-G-D

## Sheet CAN.SchDoc: Apalis Evaluation Board 1.1
size A3; Organization: Toradex AG; Address1: Altsagenstrasse 5; Address2: Horw; Address3: 6048; Address4: Switzerland; DocumentNumber: 23; Revision: V1.1; SheetNumber: 23; SheetTotal: 32; PageSetup: Record=PageOptions|CenterHorizontal=True|CenterVertical=True|PrintScale=0.73|XCorrection=1.00|YCorrection=1.00|PrintKind=0|BorderSize=5000000|LeftOffset=0|BottomOffset=0|Orientation=2|PaperLength=1000|PaperWidth=1000|Scale=100|PaperSource=7|PrintQuality=-4|MediaType=1|DitherType=10|PaperKind=A4|PrintScaleMode=1
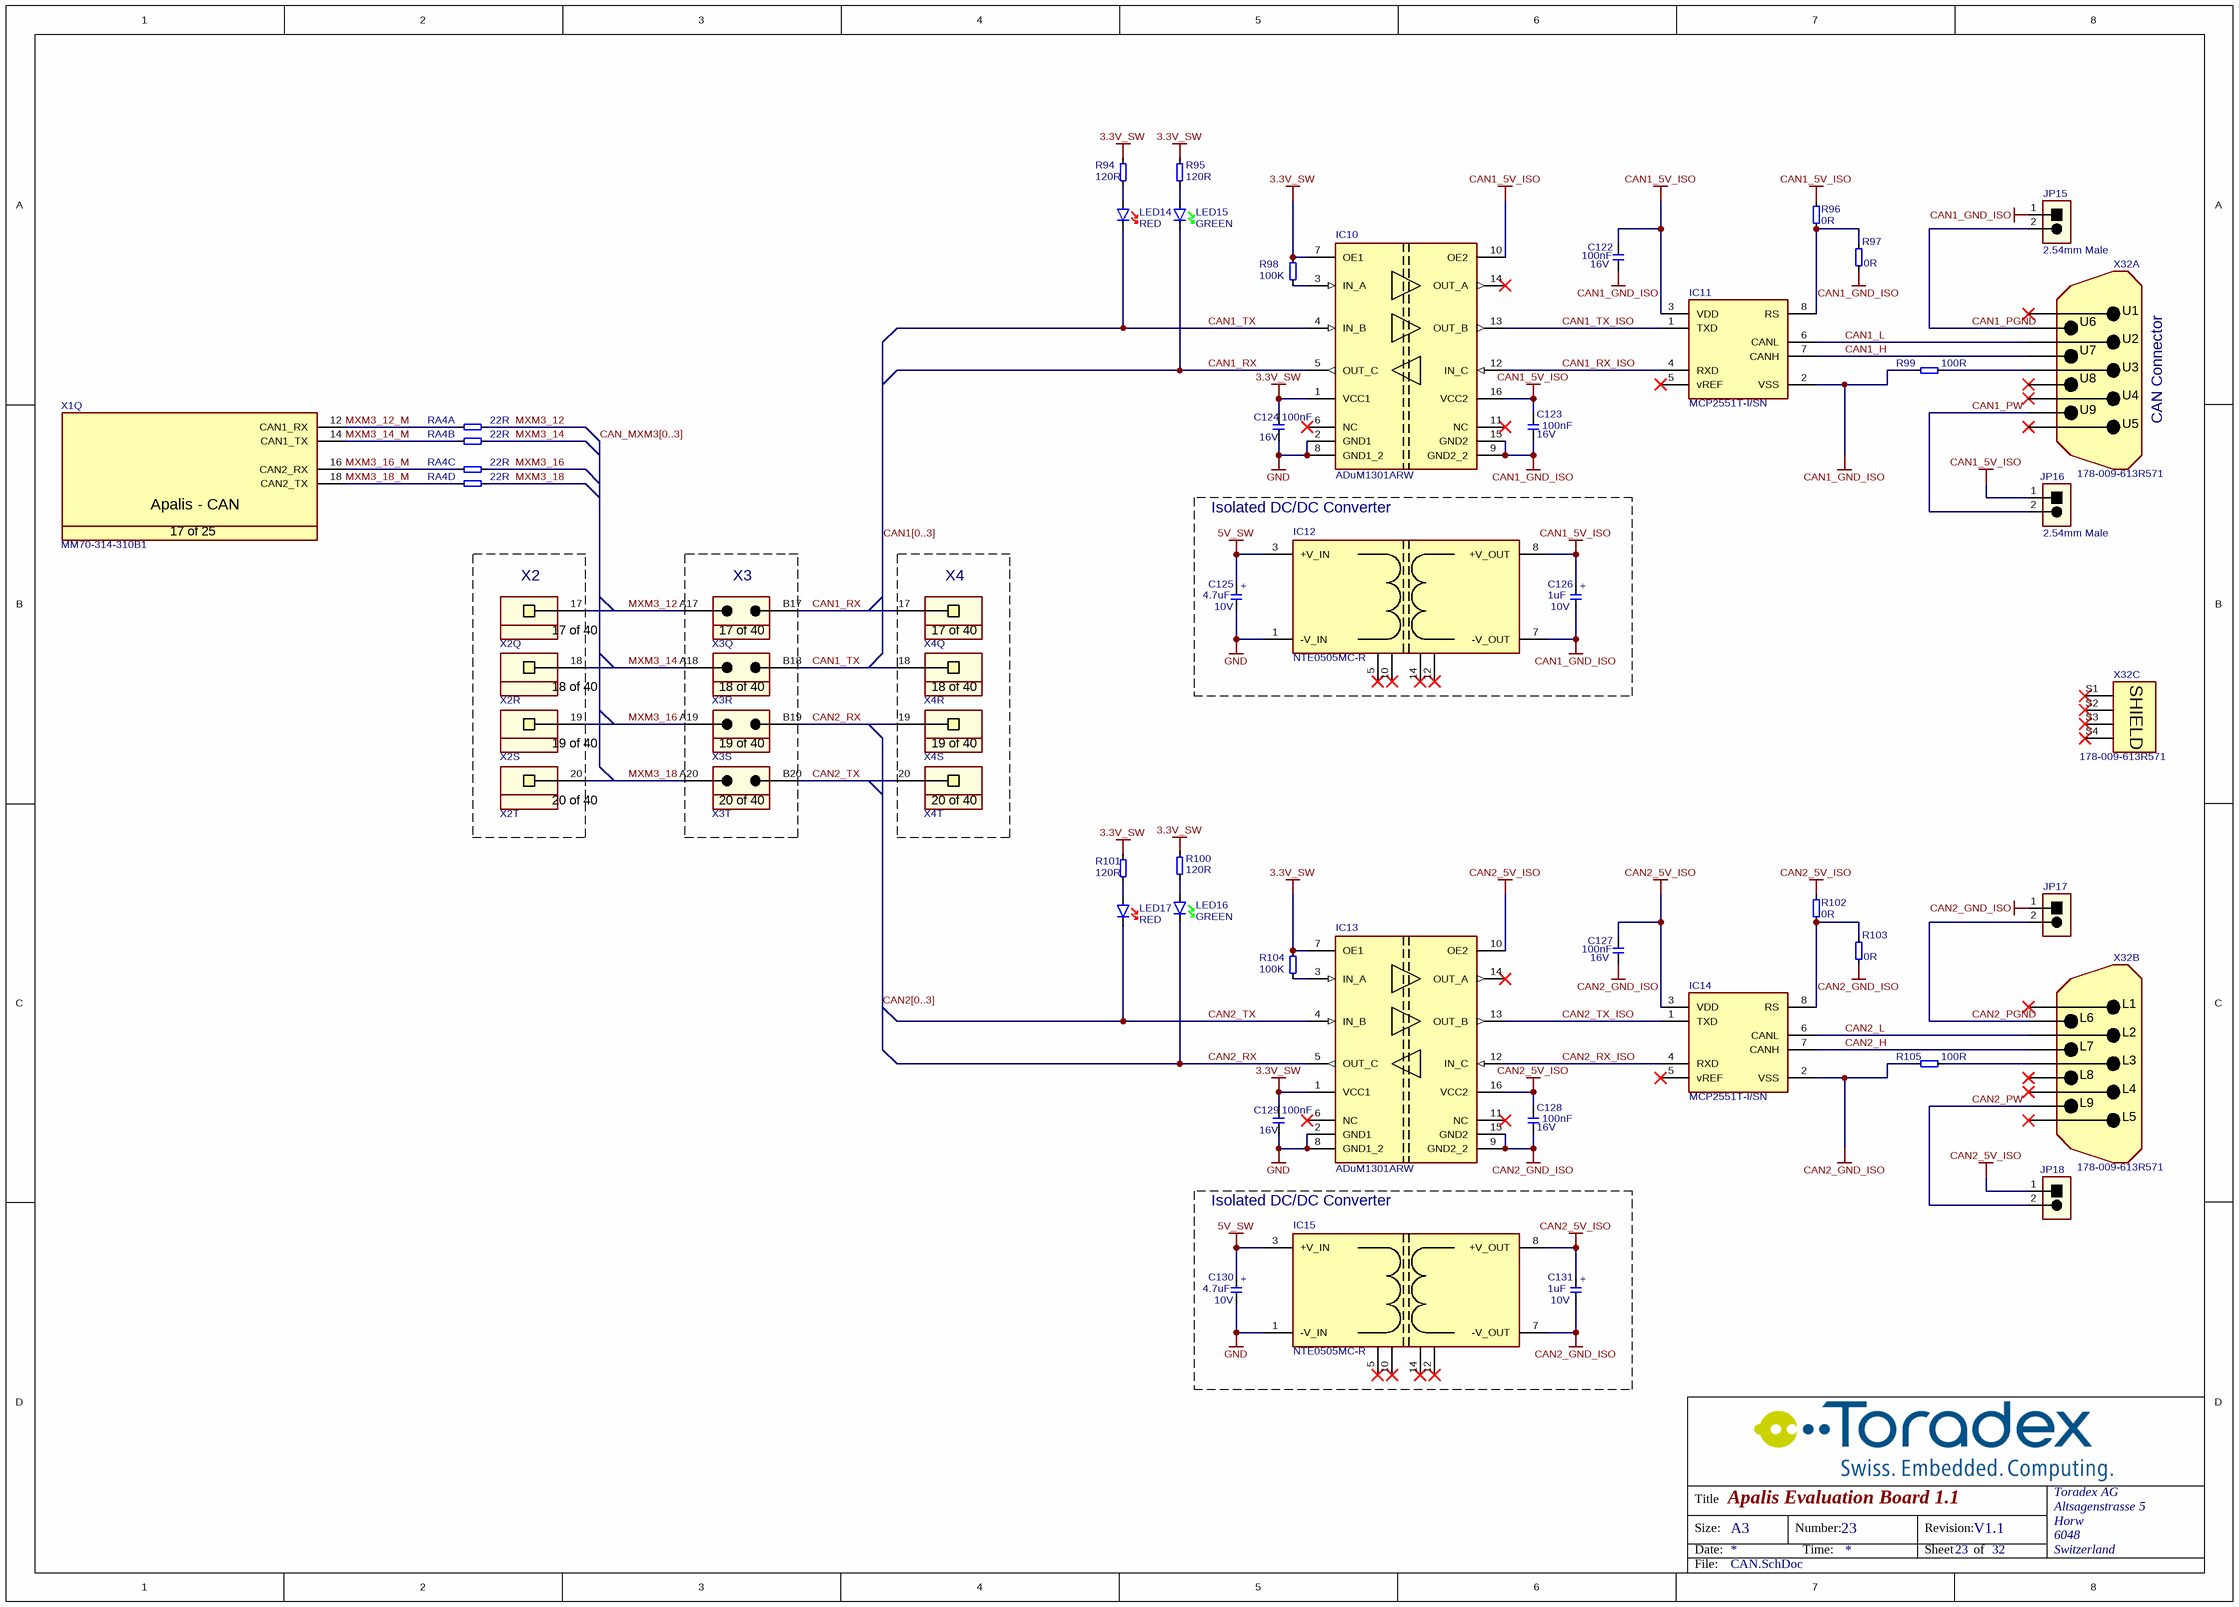
[diagram p5: CAN.SchDoc]

### Parts
C122  Rating: 16V  [T_CAPC0603X33N]  (hidden comment: 100nF)
C123  Rating: 16V  [T_CAPC0603X33N]  (hidden comment: 100nF)
C124  Rating: 16V  [T_CAPC0603X33N]  (hidden comment: 100nF)
C125  Rating: 10V  [T_CAPMP3216X180N]  (hidden comment: 4.7uF)
C126  Rating: 10V  [T_CAPMP3216X180N]  (hidden comment: 1uF)
C127  Rating: 16V  [T_CAPC0603X33N]  (hidden comment: 100nF)
C128  Rating: 16V  [T_CAPC0603X33N]  (hidden comment: 100nF)
C129  Rating: 16V  [T_CAPC0603X33N]  (hidden comment: 100nF)
C130  Rating: 10V  [T_CAPMP3216X180N]  (hidden comment: 4.7uF)
C131  Rating: 10V  [T_CAPMP3216X180N]  (hidden comment: 1uF)
IC10  ADuM1301ARW  [T_AD_ADuM1300ARW]
IC11  MCP2551T-I/SN  [SOIC127P600X173-8N]
IC12  NTE0505MC-R  [T_MURATA_NTE0505MC-R]
IC13  ADuM1301ARW  [T_AD_ADuM1300ARW]
IC14  MCP2551T-I/SN  [SOIC127P600X173-8N]
IC15  NTE0505MC-R  [T_MURATA_NTE0505MC-R]
JP15  TSW-101-07-G-D  [T_Samtec_TSW-101-07-G-D]  (value not drawn)
JP16  TSW-101-07-G-D  [T_Samtec_TSW-101-07-G-D]  (value not drawn)
JP17  TSW-101-07-G-D  [T_Samtec_TSW-101-07-G-D]  (value not drawn)
JP18  TSW-101-07-G-D  [T_Samtec_TSW-101-07-G-D]  (value not drawn)
LED14  Color: RED  [T_Osram_T670_RED]  (hidden comment: LS T670-K1L2-1)
LED15  Color: GREEN  [T_Osram_T670_GREEN]  (hidden comment: LG T670-K1L2-1)
LED16  Color: GREEN  [T_Osram_T670_GREEN]  (hidden comment: LG T670-K1L2-1)
LED17  Color: RED  [T_Osram_T670_RED]  (hidden comment: LS T670-K1L2-1)
R94  120R  [T_RESC0603X30N]
R95  120R  [T_RESC0603X30N]
R96  0R  [T_RESC0603X30N]
R97  0R  [T_RESC0603X30N]
R98  100K  [T_RESC0603X30N]
R99  100R  [T_RESC0603X30N]
R100  120R  [T_RESC0603X30N]
R101  120R  [T_RESC0603X30N]
R102  0R  [T_RESC0603X30N]
R103  0R  [T_RESC0603X30N]
R104  100K  [T_RESC0603X30N]
R105  100R  [T_RESC0603X30N]
RA4  22R  [T_Resistor_Array_X4]  (parts A,B,C,D of 4)
X1  Manufacturer Part No.: MM70-314-310B1  [T_JAE_MM70-314-310B1]  (hidden comment: CON-JAE-MM70-314-310B1-314-0.5mm)  (part Q of 25)
X2  SSW-110-01-G-S  [T_Samtec_SSW-110-01-G-S]  (value not drawn)  (parts Q,R,S,T of 40)
X3  TSW-110-07-G-D  [T_Samtec_TSW-110-07-G-D]  (value not drawn)  (parts Q,R,S,T of 40)
X4  SSW-110-01-G-S  [T_Samtec_SSW-110-01-G-S]  (value not drawn)  (parts Q,R,S,T of 40)
X32  178-009-613R571  [T_NorComp_178-YYY-613R691]  (parts A,B,C of 3)

### Blocks framed on the sheet
Isolated DC/DC Converter: C125 C126 IC12
X2: X2
X3: X3
X4: X4
Isolated DC/DC Converter: C130 C131 IC15

### Nets
3.3V_SW: C124.2 C129.2 IC10.1(VCC1) IC10.7(OE1) IC13.1(VCC1) IC13.7(OE1) R94.1 R95.1 R98.2 R100.1 R101.1 R104.2
5V_SW: C125.1 C130.1 IC12.3(+V_IN) IC15.3(+V_IN)
CAN1_5V_ISO: C122.2 C123.2 C126.1 IC10.10(OE2) IC10.16(VCC2) IC11.3(VDD) IC12.8(+V_OUT) JP16.1 R96.2
CAN1_GND_ISO: C122.1 C123.1 C126.2 IC10.9(GND2_2) IC10.15(GND2) IC11.2(VSS) IC12.7(-V_OUT) JP15.1 R97.1 R99.2
CAN2_5V_ISO: C127.2 C128.2 C131.1 IC13.10(OE2) IC13.16(VCC2) IC14.3(VDD) IC15.8(+V_OUT) JP18.1 R102.2
CAN2_GND_ISO: C127.1 C128.1 C131.2 IC13.9(GND2_2) IC13.15(GND2) IC14.2(VSS) IC15.7(-V_OUT) JP17.1 R103.1 R105.2
GND: C124.1 C125.2 C129.1 C130.2 IC10.2(GND1) IC10.8(GND1_2) IC12.1(-V_IN) IC13.2(GND1) IC13.8(GND1_2) IC15.1(-V_IN)
CAN1_H: IC11.7(CANH) X32.U7(RTS)
CAN1_L: IC11.6(CANL) X32.U2(RXD)
CAN1_PGND: JP15.2 X32.U6(DSR)
CAN1_PW: JP16.2 X32.U9(RI)
CAN1_RX: IC10.5(OUT_C) LED15.K X3.B17 X4.17
CAN1_RX_ISO: IC10.12(IN_C) IC11.4(RXD)
CAN1_TX: IC10.4(IN_B) LED14.K X3.B18 X4.18
CAN1_TX_ISO: IC10.13(OUT_B) IC11.1(TXD)
CAN2_H: IC14.7(CANH) X32.L7(RTS)
CAN2_L: IC14.6(CANL) X32.L2(RXD)
CAN2_PGND: JP17.2 X32.L6(DSR)
CAN2_PW: JP18.2 X32.L9(RI)
CAN2_RX: IC13.5(OUT_C) LED16.K X3.B19 X4.19
CAN2_RX_ISO: IC13.12(IN_C) IC14.4(RXD)
CAN2_TX: IC13.4(IN_B) LED17.K X3.B20 X4.20
CAN2_TX_ISO: IC13.13(OUT_B) IC14.1(TXD)
MXM3_12: RA4.5 X2.17 X3.A17
MXM3_12_M: RA4.1 X1.12(CAN1_RX)
MXM3_14: RA4.6 X2.18 X3.A18
MXM3_14_M: RA4.2 X1.14(CAN1_TX)
MXM3_16: RA4.7 X2.19 X3.A19
MXM3_16_M: RA4.3 X1.16(CAN2_RX)
MXM3_18: RA4.8 X2.20 X3.A20
MXM3_18_M: RA4.4 X1.18(CAN2_TX)
NetIC10_3: IC10.3(IN_A) R98.1
NetIC11_8: IC11.8(RS) R96.1 R97.2
NetIC13_3: IC13.3(IN_A) R104.1
NetIC14_8: IC14.8(RS) R102.1 R103.2
NetLED14_A: LED14.A R94.2
NetLED15_A: LED15.A R95.2
NetLED16_A: LED16.A R100.2
NetLED17_A: LED17.A R101.2
NetR99_1: R99.1 X32.U3(TXD)
NetR105_1: R105.1 X32.L3(TXD)

Not connected (* = marked no-connect by the designer): IC10 6(NC)* 11(NC)* 14(OUT_A)*; IC11 5(vREF)*; IC12 5(NC)* 10(NC)* 12(NC)* 14(NC)*; IC13 6(NC)* 11(NC)* 14(OUT_A)*; IC14 5(vREF)*; IC15 5(NC)* 10(NC)* 12(NC)* 14(NC)*; X32 L1(DCD)* L4(DTR)* L5(GND)* L8(CTS)* S1(SHIELD)* S2(SHIELD)* S3(SHIELD)* S4(SHIELD)* U1(DCD)* U4(DTR)* U5(GND)* U8(CTS)*

### Buses and harness runs
bus CAN1[0..3]
bus CAN2[0..3]
bus CAN_MXM3[0..3]

### Notes on the sheet
- (near JP15) 2.54mm Male
- CAN Connector
- (near JP16) 2.54mm Male
- Title
- Size:
- Date:
- A3
- Number:
- Time:
- Revision:
- Sheet
- of
- File:
- (in symbol C-TA-1uF-10V-20%-3216) +
- (in symbol C-TA-4.7uF-10V-20%-3216) +
- (in symbol CON-JAE-MM70-314-310B1-314-0.5mm, part Q) Apalis - CAN; 17 of 25
- (in symbol CON-Samtec-SSW-110-01-G-S, part Q) 17 of 40
- (in symbol CON-Samtec-SSW-110-01-G-S, part R) 18 of 40
- (in symbol CON-Samtec-SSW-110-01-G-S, part S) 19 of 40
- (in symbol CON-Samtec-SSW-110-01-G-S, part T) 20 of 40
- (in symbol CON-Samtec-TSW-110-07-G-D, part Q) 17 of 40
- (in symbol CON-Samtec-TSW-110-07-G-D, part R) 18 of 40
- (in symbol CON-Samtec-TSW-110-07-G-D, part S) 19 of 40
- (in symbol CON-Samtec-TSW-110-07-G-D, part T) 20 of 40

### Library data of the parts
C122-C124 C127-C129 = C-X7R-100nF-16V-10%-0603: Capacitor Ceramic X7R 100nF 16V 10% 0603; Tolerance: 10%; Type: X7R; Value: 100nF
C125 C130 = C-TA-4.7uF-10V-20%-3216: Capacitor TA 4.7uF 10V 20% 3216; Tolerance: 20%; Type: TA; Value: 4.7uF
C126 C131 = C-TA-1uF-10V-20%-3216: Capacitor TA 1uF 10V 20% 3216; Tolerance: 20%; Type: TA; Value: 1uF
IC10 IC13 = IC-AD-ADuM1301ARW: Digital Isolator; Manufacturer Name: Analog Devices; Manufacturer Part No.: ADuM1301ARW
IC11 IC14 = IC-MC-MCP2551T-I/SN: High speed CAN Transceiver; Manufacturer Name: Microchip; Manufacturer Part No.: MCP2551T-I/SN
IC12 IC15 = IC-MUR-NTE0505MC-R: Isolated DC/DC Converter; Manufacturer Name: Murata; Manufacturer Part No.: NTE0505MC-R
JP15-JP18 = CON-Samtec-TSW-101-07-G-D: Header male, 1x2 Pins, 2.54 mm pitch; Manufacturer Name: Samtec; Pitch: 2.54 mm; No. of ways: 1x2; Manufacturer Part no.: TSW-101-07-G-D
LED14 LED17 = LED-Osram-LS T670-K1L2-1: LED red, Osram LS T670-K1L2-1; Manufacturer Name: Osram; Manufacturer Part No.: LS T670-K1L2-1
LED15 LED16 = LED-Osram-T670-K1L2-1: LED green Osram LG T670-K1L2-1; Manufacturer Name: Osram; Manufacturer Part No.: LG T670-K1L2-1
R94 R95 R100 R101 = R-120R-63mW-5%-0603: Resistor 120 ohm 63mW 5% 0603; Rating: 63mW; Tolerance: 5%; Value: 120R
R96 R97 R102 R103 = R-0R-63mW-1%-0603: Resistor 0 ohm 63mW 1% 0603; Rating: 63mW; Tolerance: 1%; Value: 0R
R98 R104 = R-100KR-63mW-5%-0603: Resistor 100 Kohm 63mW 5% 0603; Value: 100KR; Rating: 63mW; Tolerance: 5%
R99 R105 = R-100R-63mW-5%-0603: Resistor 100 ohm 63mW 5% 0603; Rating: 63mW; Tolerance: 5%; Value: 100R
RA4 = RA-22R-63mW-5%-1206-div: Resistor Array 22 R 63mW 5% 1206; Tolerance: 5%; Power Dissipation: 63mW; Value: 22R
X1 = CON-JAE-MM70-314-310B1-314-0.5mm: as X1 on sheet Analogue_Audio
X2 X4 = CON-Samtec-SSW-110-01-G-S: as X2 on sheet Analog_IOs; Pitch: 2.54mm; No. of ways: 1x40; Manufacturer Part No.: SSW-110-01-G-S
X3 = CON-Samtec-TSW-110-07-G-D: as X3 on sheet Analog_IOs; Pitch: 2.54mm; No. of ways: 2x40; Manufacturer Part No.: TSW-110-07-G-D
X32 = CON-NorComp-178-009-613R571: RS232 Connector 9 pins male; No. of Ways: 18; Manufacturer Name: NorComp; Manufacturer Part No.: 178-009-613R571

## Sheet Ethernet.SchDoc: Apalis Evaluation Board 1.1
size A3; Organization: Toradex AG; Address1: Altsagenstrasse 5; Address2: Horw; Address3: 6048; Address4: Switzerland; DocumentNumber: 9; Revision: V1.1; SheetNumber: 9; SheetTotal: 32; PageSetup: Record=PageOptions|CenterHorizontal=True|CenterVertical=True|PrintScale=0.73|XCorrection=1.00|YCorrection=1.00|PrintKind=0|BorderSize=5000000|LeftOffset=0|BottomOffset=0|Orientation=2|PaperLength=1000|PaperWidth=1000|Scale=100|PaperSource=7|PrintQuality=-4|MediaType=1|DitherType=10|PaperKind=A4|PrintScaleMode=1
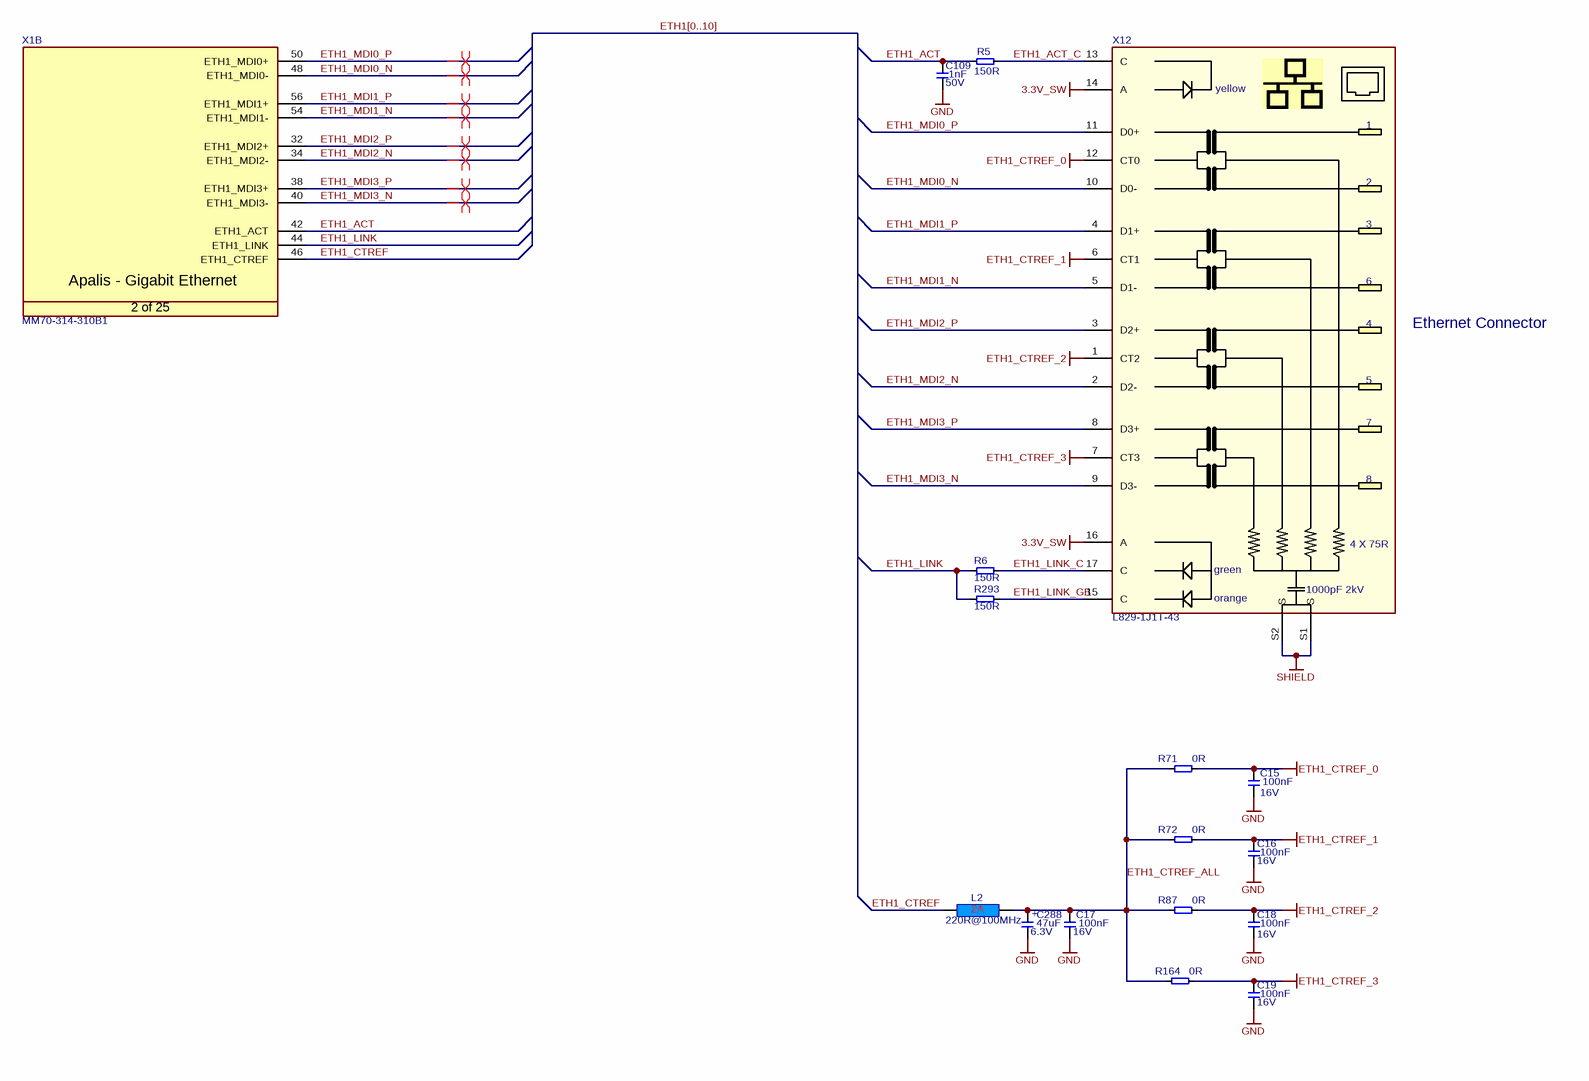
[diagram p6: Ethernet.SchDoc]

### Parts
C15  Rating: 16V  [T_CAPC0603X33N]  (hidden comment: 100nF)
C16  Rating: 16V  [T_CAPC0603X33N]  (hidden comment: 100nF)
C17  Rating: 16V  [T_CAPC0603X33N]  (hidden comment: 100nF)
C18  Rating: 16V  [T_CAPC0603X33N]  (hidden comment: 100nF)
C19  Rating: 16V  [T_CAPC0603X33N]  (hidden comment: 100nF)
C109  Rating: 50V  [CAPC1005X60N]  (hidden comment: 1nF)
C288  Rating: 6.3V  [T_CAPMP3216X180N]  (hidden comment: 47uF)
L2  220R@100MHz  [INDC1608X95N]
R5  150R  [t_RESC0603X30N]
R6  150R  [t_RESC0603X30N]
R71  0R  [T_RESC0603X30N]
R72  0R  [T_RESC0603X30N]
R87  0R  [T_RESC0603X30N]
R164  0R  [T_RESC0603X30N]
R293  150R  [t_RESC0603X30N]
X1  Manufacturer Part No.: MM70-314-310B1  [T_JAE_MM70-314-310B1]  (hidden comment: CON-JAE-MM70-314-310B1-314-0.5mm)  (part B of 25)
X12  L829-1J1T-43  [T_BEL_L829-1J1T-43]

### Nets
3.3V_SW: X12.14(A) X12.16(A)
ETH1_CTREF_0: C15.2 R71.2 X12.12(CT0)
ETH1_CTREF_1: C16.2 R72.2 X12.6(CT1)
ETH1_CTREF_2: C18.2 R87.2 X12.1(CT2)
ETH1_CTREF_3: C19.2 R164.2 X12.7(CT3)
GND: C15.1 C16.1 C17.1 C18.1 C19.1 C109.1 C288.2
SHIELD: X12.S1(S) X12.S2(S)
ETH1_ACT: C109.2 R5.1 X1.42(ETH1_ACT)
ETH1_ACT_C: R5.2 X12.13(C)
ETH1_CTREF: L2.1 X1.46(ETH1_CTREF)
ETH1_CTREF_ALL: C17.2 C288.1 L2.2 R71.1 R72.1 R87.1 R164.1
ETH1_LINK: R6.1 R293.1 X1.44(ETH1_LINK)
ETH1_LINK_C: R6.2 X12.17(C)
ETH1_LINK_GB: R293.2 X12.15(C)
ETH1_MDI0_N: X1.48(ETH1_MDI0-) X12.10(D0-)
ETH1_MDI0_P: X1.50(ETH1_MDI0+) X12.11(D0+)
ETH1_MDI1_N: X1.54(ETH1_MDI1-) X12.5(D1-)
ETH1_MDI1_P: X1.56(ETH1_MDI1+) X12.4(D1+)
ETH1_MDI2_N: X1.34(ETH1_MDI2-) X12.2(D2-)
ETH1_MDI2_P: X1.32(ETH1_MDI2+) X12.3(D2+)
ETH1_MDI3_N: X1.40(ETH1_MDI3-) X12.9(D3-)
ETH1_MDI3_P: X1.38(ETH1_MDI3+) X12.8(D3+)

### Buses and harness runs
bus ETH1[0..10]

### Layout directives
differential pair: ETH1_MDI0_N, ETH1_MDI0_P, ETH1_MDI1_N, ETH1_MDI1_P, ETH1_MDI2_N, ETH1_MDI2_P, ETH1_MDI3_N, ETH1_MDI3_P

### Notes on the sheet
- Ethernet Connector
- Title
- Size:
- Date:
- A3
- Number:
- Time:
- Revision:
- Sheet
- of
- File:
- (in symbol C-TA-47uF-6.3V-20%-3216) +
- (in symbol CON-BEL-L829-1J1T-43) yellow; 4 X 75R; green; 1000pF 2kV; orange
- (in symbol CON-JAE-MM70-314-310B1-314-0.5mm, part B) Apalis - Gigabit Ethernet; 2 of 25

### Library data of the parts
C15-C19 = C-X7R-100nF-16V-10%-0603: Capacitor Ceramic X7R 100nF 16V 10% 0603; Tolerance: 10%; Type: X7R; Value: 100nF
C109 = C-X7R-1nF-50V-10%-0402: Capacitor Ceramic X7R 1nF 50V 10% 0402; Tolerance: 10%; Type: X7R; Value: 1nF
C288 = C-TA-47uF-6.3V-20%-3216: Capacitor TA 47uF 6.3V 20% 3216; Tolerance: 20%; Type: TA; Value: 47uF
L2 = L-220R@100MHz-2A-25%-0603: as L1 on sheet Analogue_Audio; Rating: 2A; Value: 220R@100MHz
R5 R6 R293 = R-150R-63mW-1%-0603: Resistor 150 ohm 63mW 1% 0603; Tolerance: 1%; Value: 150R; Rating: 63mW
R71 R72 R87 R164 = R-0R-63mW-1%-0603: Resistor 0 ohm 63mW 1% 0603; Rating: 63mW; Tolerance: 1%; Value: 0R
X1 = CON-JAE-MM70-314-310B1-314-0.5mm: as X1 on sheet Analogue_Audio
X12 = CON-BEL-L829-1J1T-43: Low profile 10/100/1G Mag Jack; Manufacturer Name: BEL; Manufacturer Part No.: L829-1J1T-43

## Sheet GPIOs.SchDoc: Apalis Evaluation Board 1.1
size A3; Organization: Toradex AG; Address1: Altsagenstrasse 5; Address2: Horw; Address3: 6048; Address4: Switzerland; DocumentNumber: 10; Revision: V1.1; SheetNumber: 10; SheetTotal: 32; PageSetup: Record=PageOptions|CenterHorizontal=True|CenterVertical=True|PrintScale=0.73|XCorrection=1.00|YCorrection=1.00|PrintKind=0|BorderSize=5000000|LeftOffset=0|BottomOffset=0|Orientation=2|PaperLength=1000|PaperWidth=1000|Scale=100|PaperSource=7|PrintQuality=-4|MediaType=1|DitherType=10|PaperKind=A4|PrintScaleMode=1
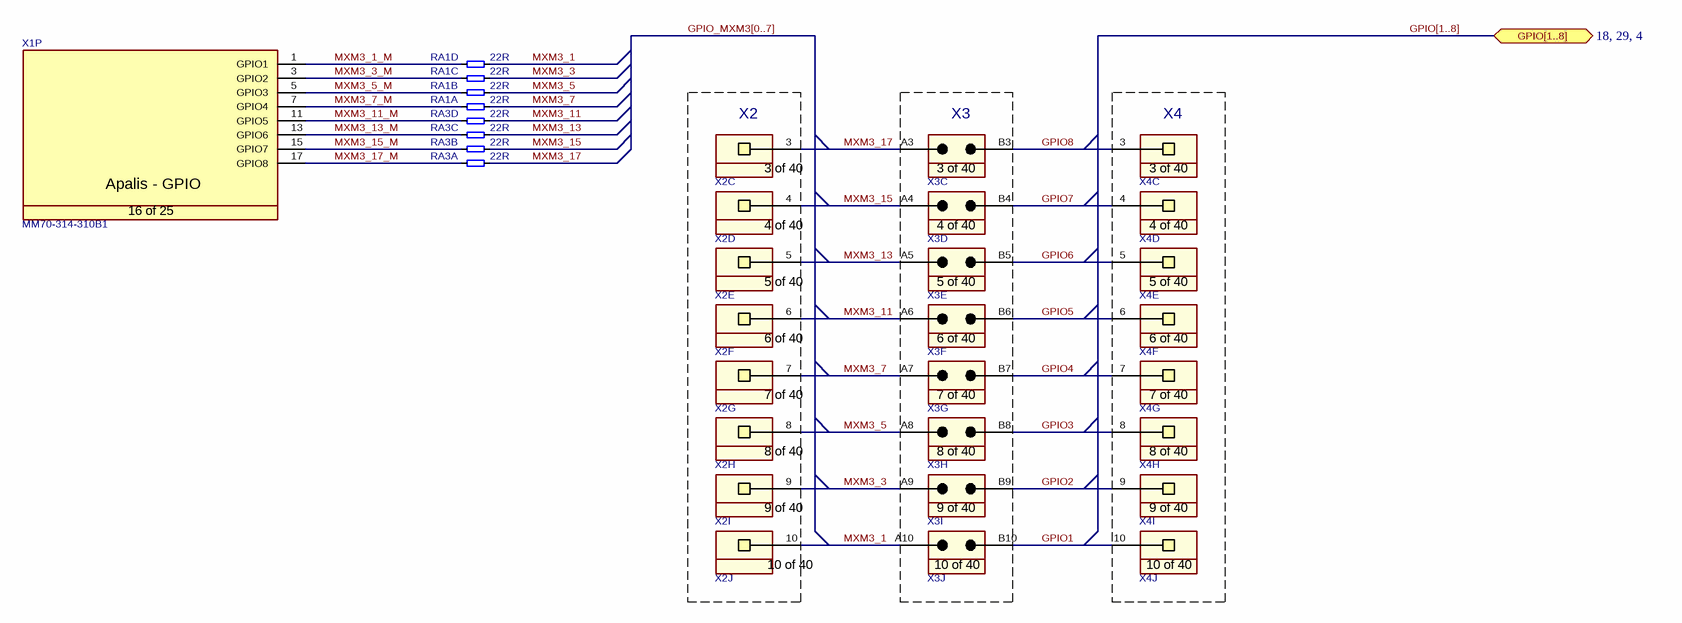
[diagram p7: GPIOs.SchDoc]

### Parts
RA1  22R  [T_Resistor_Array_X4]  (parts A,B,C,D of 4)
RA3  22R  [T_Resistor_Array_X4]  (parts A,B,C,D of 4)
X1  Manufacturer Part No.: MM70-314-310B1  [T_JAE_MM70-314-310B1]  (hidden comment: CON-JAE-MM70-314-310B1-314-0.5mm)  (part P of 25)
X2  SSW-110-01-G-S  [T_Samtec_SSW-110-01-G-S]  (value not drawn)  (parts C,D,E,F,G,H,I,J of 40)
X3  TSW-110-07-G-D  [T_Samtec_TSW-110-07-G-D]  (value not drawn)  (parts C,D,E,F,G,H,I,J of 40)
X4  SSW-110-01-G-S  [T_Samtec_SSW-110-01-G-S]  (value not drawn)  (parts C,D,E,F,G,H,I,J of 40)

### Blocks framed on the sheet
X2: X2
X3: X3
X4: X4

### Ports
GPIO[1..8] (bidir, see 18, 29, 4)

### Nets
GPIO1: X3.B10 X4.10
GPIO2: X3.B9 X4.9
GPIO3: X3.B8 X4.8
GPIO4: X3.B7 X4.7
GPIO5: X3.B6 X4.6
GPIO6: X3.B5 X4.5
GPIO7: X3.B4 X4.4
GPIO8: X3.B3 X4.3
MXM3_1: RA1.8 X2.10 X3.A10
MXM3_1_M: RA1.4 X1.1(GPIO1)
MXM3_3: RA1.7 X2.9 X3.A9
MXM3_3_M: RA1.3 X1.3(GPIO2)
MXM3_5: RA1.6 X2.8 X3.A8
MXM3_5_M: RA1.2 X1.5(GPIO3)
MXM3_7: RA1.5 X2.7 X3.A7
MXM3_7_M: RA1.1 X1.7(GPIO4)
MXM3_11: RA3.8 X2.6 X3.A6
MXM3_11_M: RA3.4 X1.11(GPIO5)
MXM3_13: RA3.7 X2.5 X3.A5
MXM3_13_M: RA3.3 X1.13(GPIO6)
MXM3_15: RA3.6 X2.4 X3.A4
MXM3_15_M: RA3.2 X1.15(GPIO7)
MXM3_17: RA3.5 X2.3 X3.A3
MXM3_17_M: RA3.1 X1.17(GPIO8)

### Buses and harness runs
bus GPIO[1..8] = port GPIO[1..8]
bus GPIO_MXM3[0..7]

### Notes on the sheet
- Title
- Size:
- Date:
- A3
- Number:
- Time:
- Revision:
- Sheet
- of
- File:
- (in symbol CON-JAE-MM70-314-310B1-314-0.5mm, part P) Apalis - GPIO; 16 of 25
- (in symbol CON-Samtec-SSW-110-01-G-S, part C) 3 of 40
- (in symbol CON-Samtec-SSW-110-01-G-S, part D) 4 of 40
- (in symbol CON-Samtec-SSW-110-01-G-S, part E) 5 of 40
- (in symbol CON-Samtec-SSW-110-01-G-S, part F) 6 of 40
- (in symbol CON-Samtec-SSW-110-01-G-S, part G) 7 of 40
- (in symbol CON-Samtec-SSW-110-01-G-S, part H) 8 of 40
- (in symbol CON-Samtec-SSW-110-01-G-S, part I) 9 of 40
- (in symbol CON-Samtec-SSW-110-01-G-S, part J) 10 of 40
- (in symbol CON-Samtec-TSW-110-07-G-D, part C) 3 of 40
- (in symbol CON-Samtec-TSW-110-07-G-D, part D) 4 of 40
- (in symbol CON-Samtec-TSW-110-07-G-D, part E) 5 of 40
- (in symbol CON-Samtec-TSW-110-07-G-D, part F) 6 of 40
- (in symbol CON-Samtec-TSW-110-07-G-D, part G) 7 of 40
- (in symbol CON-Samtec-TSW-110-07-G-D, part H) 8 of 40
- (in symbol CON-Samtec-TSW-110-07-G-D, part I) 9 of 40
- (in symbol CON-Samtec-TSW-110-07-G-D, part J) 10 of 40

### Library data of the parts
RA1 RA3 = RA-22R-63mW-5%-1206-div: Resistor Array 22 R 63mW 5% 1206; Tolerance: 5%; Power Dissipation: 63mW; Value: 22R
X1 = CON-JAE-MM70-314-310B1-314-0.5mm: as X1 on sheet Analogue_Audio
X2 X4 = CON-Samtec-SSW-110-01-G-S: as X2 on sheet Analog_IOs; Pitch: 2.54mm; No. of ways: 1x40; Manufacturer Part No.: SSW-110-01-G-S
X3 = CON-Samtec-TSW-110-07-G-D: as X3 on sheet Analog_IOs; Pitch: 2.54mm; No. of ways: 2x40; Manufacturer Part No.: TSW-110-07-G-D

## Sheet HDA_Connectors.SchDoc: Apalis Evaluation Board 1.1
size A3; Organization: Toradex AG; Address1: Altsagenstrasse 5; Address2: Horw; Address3: 6048; Address4: Switzerland; DocumentNumber: 12; Revision: V1.1; SheetNumber: 12; SheetTotal: 32; PageSetup: Record=PageOptions|CenterHorizontal=True|CenterVertical=True|PrintScale=0.73|XCorrection=1.00|YCorrection=1.00|PrintKind=0|BorderSize=5000000|LeftOffset=0|BottomOffset=0|Orientation=2|PaperLength=1000|PaperWidth=1000|Scale=100|PaperSource=7|PrintQuality=-4|MediaType=1|DitherType=10|PaperKind=A4|PrintScaleMode=1
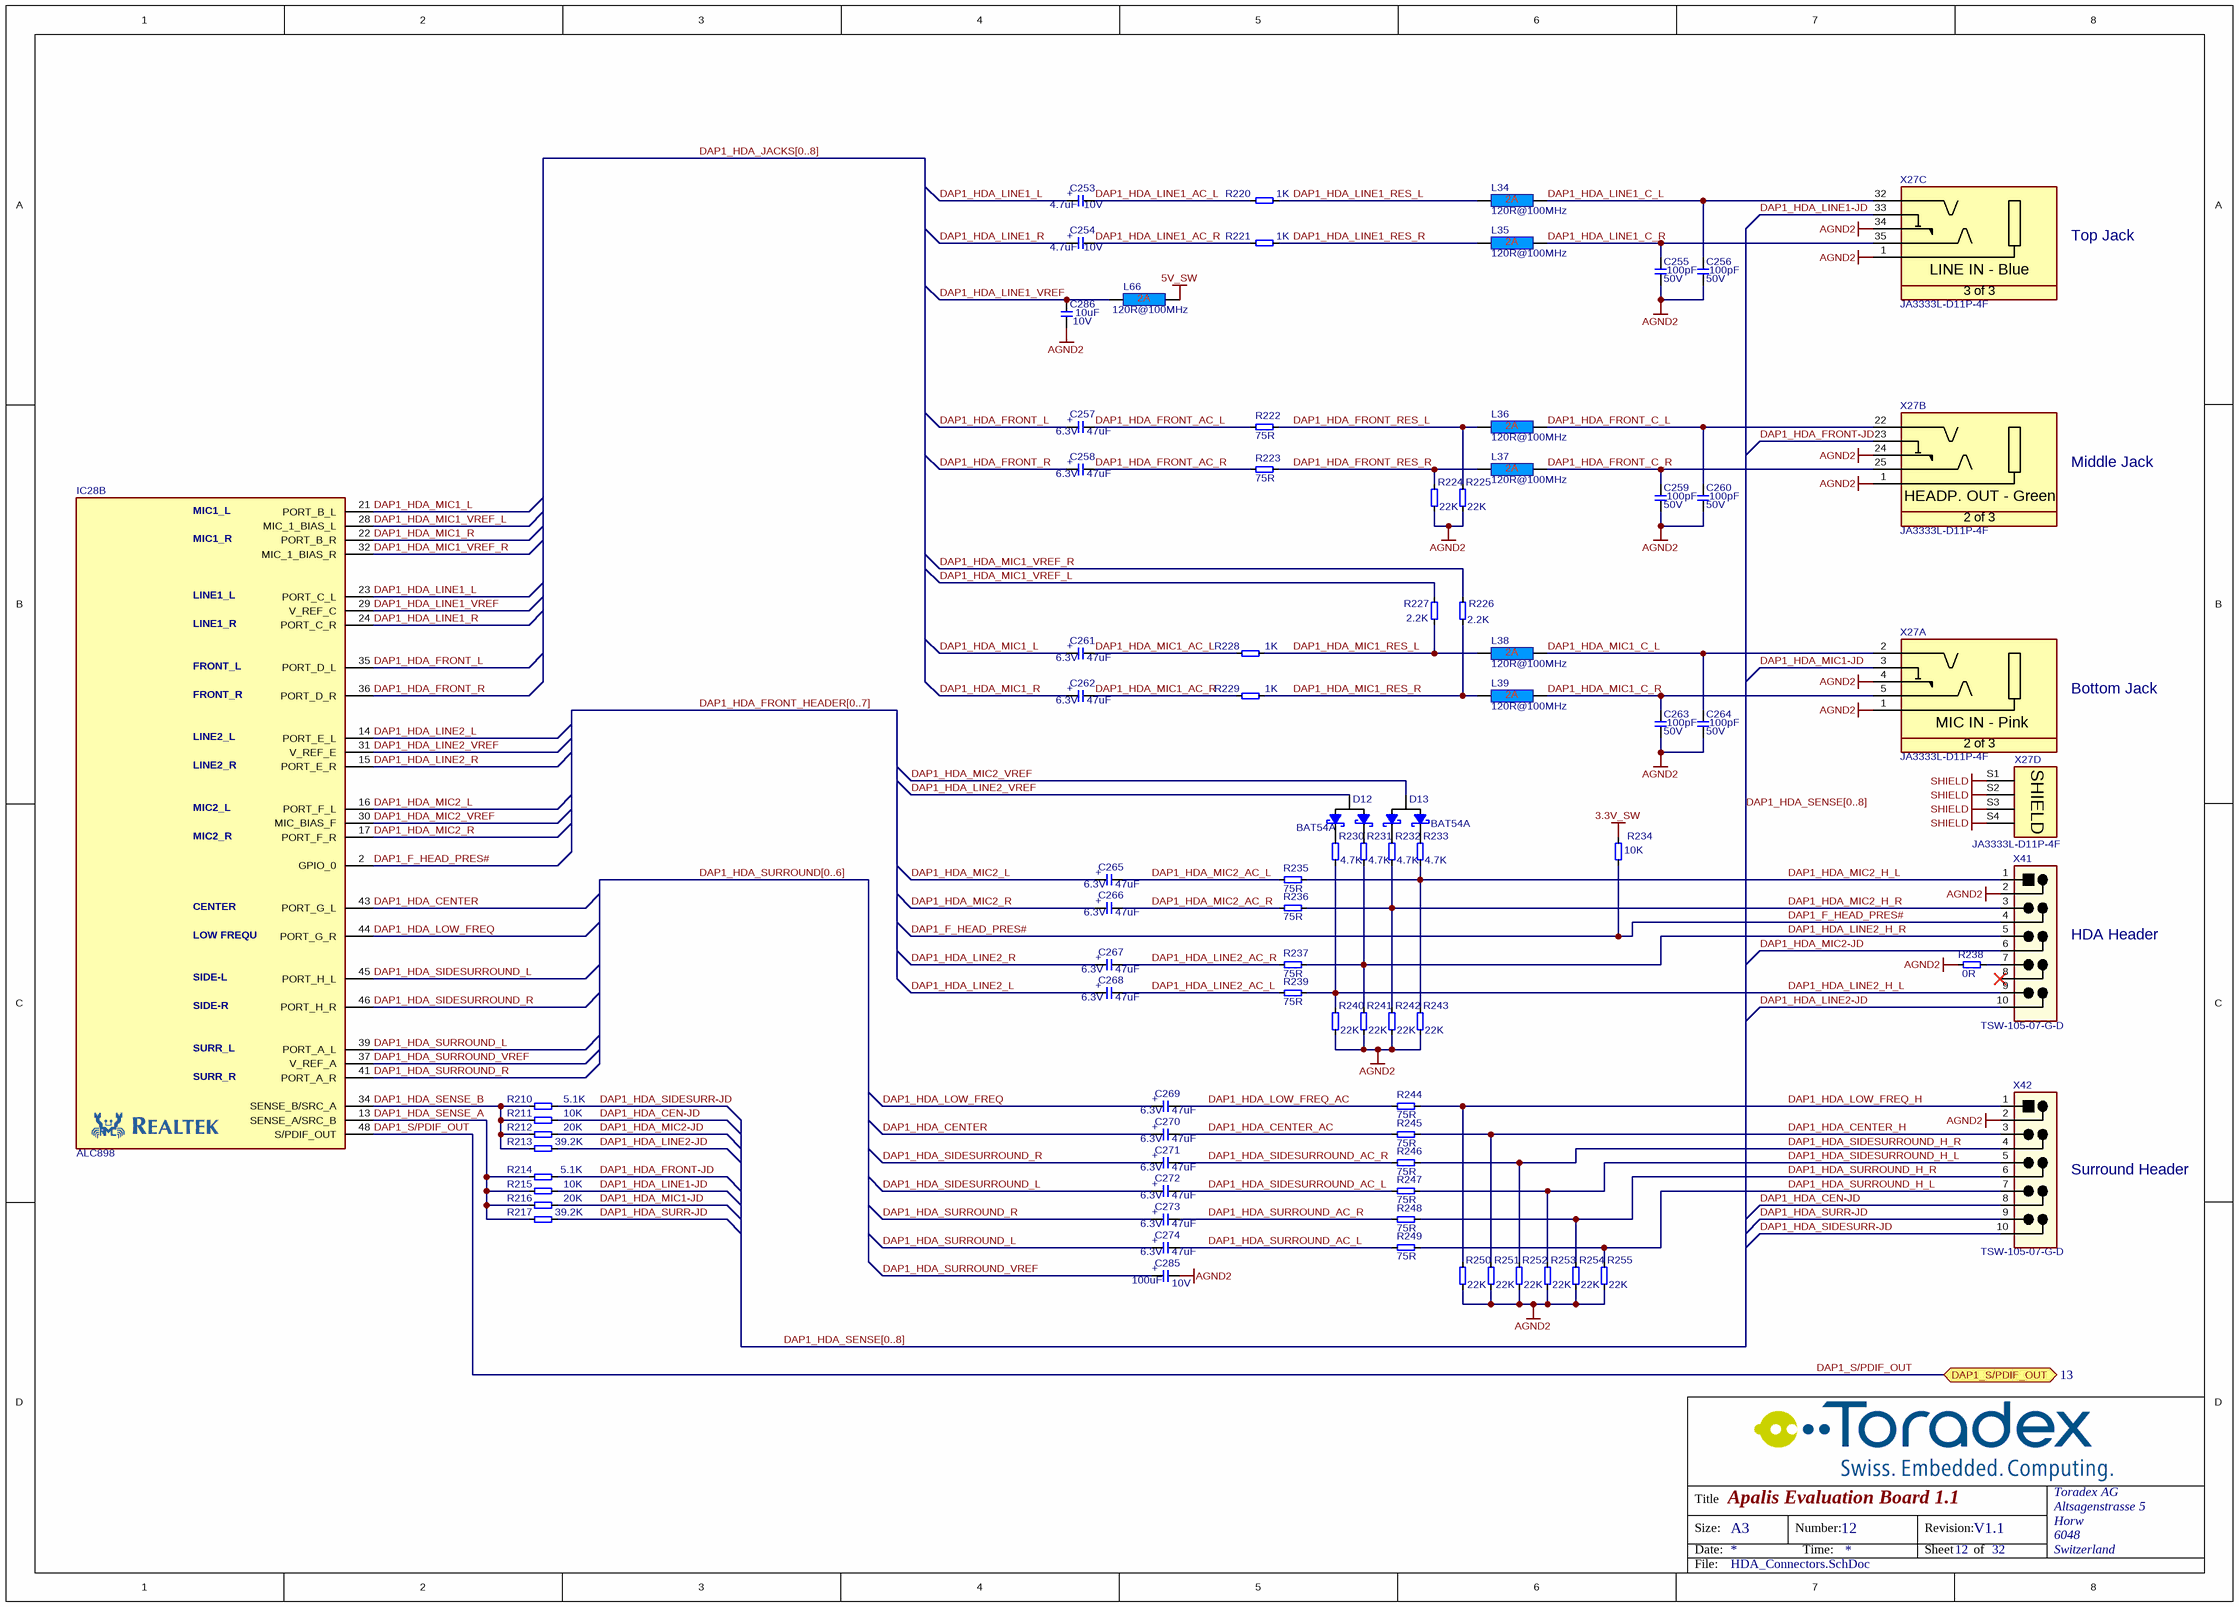
[diagram p8: HDA_Connectors.SchDoc]

### Parts
C253  Rating: 10V  [T_CAPMP3216X180N]  (hidden comment: 4.7uF)
C254  Rating: 10V  [T_CAPMP3216X180N]  (hidden comment: 4.7uF)
C255  Rating: 50V  [CAPC1005X60N]  (hidden comment: 100pF)
C256  Rating: 50V  [CAPC1005X60N]  (hidden comment: 100pF)
C257  Rating: 6.3V  [T_CAPMP3216X180N]  (hidden comment: 47uF)
C258  Rating: 6.3V  [T_CAPMP3216X180N]  (hidden comment: 47uF)
C259  Rating: 50V  [CAPC1005X60N]  (hidden comment: 100pF)
C260  Rating: 50V  [CAPC1005X60N]  (hidden comment: 100pF)
C261  Rating: 6.3V  [T_CAPMP3216X180N]  (hidden comment: 47uF)
C262  Rating: 6.3V  [T_CAPMP3216X180N]  (hidden comment: 47uF)
C263  Rating: 50V  [CAPC1005X60N]  (hidden comment: 100pF)
C264  Rating: 50V  [CAPC1005X60N]  (hidden comment: 100pF)
C265  Rating: 6.3V  [T_CAPMP3216X180N]  (hidden comment: 47uF)
C266  Rating: 6.3V  [T_CAPMP3216X180N]  (hidden comment: 47uF)
C267  Rating: 6.3V  [T_CAPMP3216X180N]  (hidden comment: 47uF)
C268  Rating: 6.3V  [T_CAPMP3216X180N]  (hidden comment: 47uF)
C269  Rating: 6.3V  [T_CAPMP3216X180N]  (hidden comment: 47uF)
C270  Rating: 6.3V  [T_CAPMP3216X180N]  (hidden comment: 47uF)
C271  Rating: 6.3V  [T_CAPMP3216X180N]  (hidden comment: 47uF)
C272  Rating: 6.3V  [T_CAPMP3216X180N]  (hidden comment: 47uF)
C273  Rating: 6.3V  [T_CAPMP3216X180N]  (hidden comment: 47uF)
C274  Rating: 6.3V  [T_CAPMP3216X180N]  (hidden comment: 47uF)
C285  Rating: 10V  [CAPMP3528X210N]  (hidden comment: 100uF)
C286  Rating: 10V  [T_CAPC0603X33N]  (hidden comment: 10uF)
D12  BAT54A  [SOT95P230X110-3N]
D13  BAT54A  [SOT95P230X110-3N]
IC28  ALC898  [TSQFP50P900X900X160-48N]  (part B of 2)
L34  120R@100MHz  [INDC1608X95N]
L35  120R@100MHz  [INDC1608X95N]
L36  120R@100MHz  [INDC1608X95N]
L37  120R@100MHz  [INDC1608X95N]
L38  120R@100MHz  [INDC1608X95N]
L39  120R@100MHz  [INDC1608X95N]
L66  120R@100MHz  [INDC1608X95N]
R210  5.1K  [RESC1005X40N]
R211  10K  [RESC1005X40N]
R212  20K  [RESC1005X40N]
R213  39.2K  [RESC1005X40N]
R214  5.1K  [RESC1005X40N]
R215  10K  [RESC1005X40N]
R216  20K  [RESC1005X40N]
R217  39.2K  [RESC1005X40N]
R220  1K  [RESC1005X40N]
R221  1K  [RESC1005X40N]
R222  75R  [RESC1005X40N]
R223  75R  [RESC1005X40N]
R224  22K  [RESC1005X40N]
R225  22K  [RESC1005X40N]
R226  2.2K  [RESC1005X40N]
R227  2.2K  [RESC1005X40N]
R228  1K  [RESC1005X40N]
R229  1K  [RESC1005X40N]
R230  4.7K  [RESC1005X40N]
R231  4.7K  [RESC1005X40N]
R232  4.7K  [RESC1005X40N]
R233  4.7K  [RESC1005X40N]
R234  10K  [T_RESC0603X30N]
R235  75R  [RESC1005X40N]
R236  75R  [RESC1005X40N]
R237  75R  [RESC1005X40N]
R238  0R  [T_RESC0603X30N]
R239  75R  [RESC1005X40N]
R240  22K  [RESC1005X40N]
R241  22K  [RESC1005X40N]
R242  22K  [RESC1005X40N]
R243  22K  [RESC1005X40N]
R244  75R  [RESC1005X40N]
R245  75R  [RESC1005X40N]
R246  75R  [RESC1005X40N]
R247  75R  [RESC1005X40N]
R248  75R  [RESC1005X40N]
R249  75R  [RESC1005X40N]
R250  22K  [RESC1005X40N]
R251  22K  [RESC1005X40N]
R252  22K  [RESC1005X40N]
R253  22K  [RESC1005X40N]
R254  22K  [RESC1005X40N]
R255  22K  [RESC1005X40N]
X27  JA3333L-D11P-4F  [T_FOXCONN_JA3333L-D11P-4F]  (parts A,B,C,D of 4)
X41  TSW-105-07-G-D  [T_Samtec_TSW-105-07-G-D]
X42  TSW-105-07-G-D  [T_Samtec_TSW-105-07-G-D]

### Ports
DAP1_S/PDIF_OUT (bidir, see 13)

### Nets
3.3V_SW: R234.1
5V_SW: L66.2
AGND2: C255.1 C256.1 C259.1 C260.1 C263.1 C264.1 C285.2 C286.1 R224.1 R225.1 R238.1 R240.1 R241.1 R242.1 R243.1 R250.1 R251.1 R252.1 R253.1 R254.1 R255.1 X27.1 X27.4 X27.24 X27.34 X41.2 X42.2
SHIELD: X27.S1(SHIELD) X27.S2(SHIELD) X27.S3(SHIELD) X27.S4(SHIELD)
DAP1_F_HEAD_PRES#: IC28.2(GPIO_0) R234.2 X41.4
DAP1_HDA_CEN-JD: R211.2 X42.8
DAP1_HDA_CENTER: C270.1 IC28.43(PORT_G_L)
DAP1_HDA_CENTER_AC: C270.2 R245.1
DAP1_HDA_CENTER_H: R245.2 R251.2 X42.3
DAP1_HDA_FRONT-JD: R214.2 X27.23
DAP1_HDA_FRONT_AC_L: C257.2 R222.1
DAP1_HDA_FRONT_AC_R: C258.2 R223.1
DAP1_HDA_FRONT_C_L: C260.2 L36.2 X27.22
DAP1_HDA_FRONT_C_R: C259.2 L37.2 X27.25
DAP1_HDA_FRONT_L: C257.1 IC28.35(PORT_D_L)
DAP1_HDA_FRONT_R: C258.1 IC28.36(PORT_D_R)
DAP1_HDA_FRONT_RES_L: L36.1 R222.2 R225.2
DAP1_HDA_FRONT_RES_R: L37.1 R223.2 R224.2
DAP1_HDA_LINE1-JD: R215.2 X27.33
DAP1_HDA_LINE1_AC_L: C253.2 R220.1
DAP1_HDA_LINE1_AC_R: C254.2 R221.1
DAP1_HDA_LINE1_C_L: C256.2 L34.2 X27.32
DAP1_HDA_LINE1_C_R: C255.2 L35.2 X27.35
DAP1_HDA_LINE1_L: C253.1 IC28.23(PORT_C_L)
DAP1_HDA_LINE1_R: C254.1 IC28.24(PORT_C_R)
DAP1_HDA_LINE1_RES_L: L34.1 R220.2
DAP1_HDA_LINE1_RES_R: L35.1 R221.2
DAP1_HDA_LINE1_VREF: C286.2 IC28.29(V_REF_C) L66.1
DAP1_HDA_LINE2-JD: R213.2 X41.10
DAP1_HDA_LINE2_AC_L: C268.2 R239.1
DAP1_HDA_LINE2_AC_R: C267.2 R237.1
DAP1_HDA_LINE2_H_L: R230.1 R239.2 R240.2 X41.9
DAP1_HDA_LINE2_H_R: R231.1 R237.2 R241.2 X41.5
DAP1_HDA_LINE2_L: C268.1 IC28.14(PORT_E_L)
DAP1_HDA_LINE2_R: C267.1 IC28.15(PORT_E_R)
DAP1_HDA_LINE2_VREF: D12.3 IC28.31(V_REF_E)
DAP1_HDA_LOW_FREQ: C269.1 IC28.44(PORT_G_R)
DAP1_HDA_LOW_FREQ_AC: C269.2 R244.1
DAP1_HDA_LOW_FREQ_H: R244.2 R250.2 X42.1
DAP1_HDA_MIC1-JD: R216.2 X27.3
DAP1_HDA_MIC1_AC_L: C261.2 R228.1
DAP1_HDA_MIC1_AC_R: C262.2 R229.1
DAP1_HDA_MIC1_C_L: C264.2 L38.2 X27.2
DAP1_HDA_MIC1_C_R: C263.2 L39.2 X27.5
DAP1_HDA_MIC1_L: C261.1 IC28.21(PORT_B_L)
DAP1_HDA_MIC1_R: C262.1 IC28.22(PORT_B_R)
DAP1_HDA_MIC1_RES_L: L38.1 R227.1 R228.2
DAP1_HDA_MIC1_RES_R: L39.1 R226.1 R229.2
DAP1_HDA_MIC1_VREF_L: IC28.28(MIC_1_BIAS_L) R227.2
DAP1_HDA_MIC1_VREF_R: IC28.32(MIC_1_BIAS_R) R226.2
DAP1_HDA_MIC2-JD: R212.2 X41.6
DAP1_HDA_MIC2_AC_L: C265.2 R235.1
DAP1_HDA_MIC2_AC_R: C266.2 R236.1
DAP1_HDA_MIC2_H_L: R233.1 R235.2 R243.2 X41.1
DAP1_HDA_MIC2_H_R: R232.1 R236.2 R242.2 X41.3
DAP1_HDA_MIC2_L: C265.1 IC28.16(PORT_F_L)
DAP1_HDA_MIC2_R: C266.1 IC28.17(PORT_F_R)
DAP1_HDA_MIC2_VREF: D13.3 IC28.30(MIC_BIAS_F)
DAP1_HDA_SENSE_A: IC28.13(SENSE_A/SRC_B) R214.1 R215.1 R216.1 R217.1
DAP1_HDA_SENSE_B: IC28.34(SENSE_B/SRC_A) R210.1 R211.1 R212.1 R213.1
DAP1_HDA_SIDESURR-JD: R210.2 X42.10
DAP1_HDA_SIDESURROUND_AC_L: C272.2 R247.1
DAP1_HDA_SIDESURROUND_AC_R: C271.2 R246.1
DAP1_HDA_SIDESURROUND_H_L: R247.2 R253.2 X42.5
DAP1_HDA_SIDESURROUND_H_R: R246.2 R252.2 X42.4
DAP1_HDA_SIDESURROUND_L: C272.1 IC28.45(PORT_H_L)
DAP1_HDA_SIDESURROUND_R: C271.1 IC28.46(PORT_H_R)
DAP1_HDA_SURR-JD: R217.2 X42.9
DAP1_HDA_SURROUND_AC_L: C274.2 R249.1
DAP1_HDA_SURROUND_AC_R: C273.2 R248.1
DAP1_HDA_SURROUND_H_L: R249.2 R255.2 X42.7
DAP1_HDA_SURROUND_H_R: R248.2 R254.2 X42.6
DAP1_HDA_SURROUND_L: C274.1 IC28.39(PORT_A_L)
DAP1_HDA_SURROUND_R: C273.1 IC28.41(PORT_A_R)
DAP1_HDA_SURROUND_VREF: C285.1 IC28.37(V_REF_A)
DAP1_S/PDIF_OUT: IC28.48(S/PDIF_OUT) ; port DAP1_S/PDIF_OUT
NetD12_1: D12.1 R230.2
NetD12_2: D12.2 R231.2
NetD13_1: D13.1 R233.2
NetD13_2: D13.2 R232.2
NetR238_2: R238.2 X41.7

Not connected (* = marked no-connect by the designer): X41 8*

### Buses and harness runs
bus DAP1_HDA_FRONT_HEADER[0..7]
bus DAP1_HDA_JACKS[0..8]
bus DAP1_HDA_SENSE[0..8]
bus DAP1_HDA_SURROUND[0..6]

### Notes on the sheet
- Top Jack
- Middle Jack
- Bottom Jack
- (near X41) HDA Header
- (near X42) Surround Header
- Title
- Size:
- Date:
- A3
- Number:
- Time:
- Revision:
- Sheet
- of
- File:
- (in symbol C-TA-4.7uF-10V-20%-3216) +
- (in symbol C-TA-47uF-6.3V-20%-3216) +
- (in symbol C-TA-100uF-10V-20%-3528) +
- (in symbol CON-Foxconn-JA3333L-D11P-4F, part A) MIC IN - Pink; 2 of 3
- (in symbol CON-Foxconn-JA3333L-D11P-4F, part B) HEADP. OUT - Green; 2 of 3
- (in symbol CON-Foxconn-JA3333L-D11P-4F, part C) LINE IN - Blue; 3 of 3
- (in symbol IC-Realtek-ALC898, part B) MIC1_L; MIC1_R; LINE1_L; LINE1_R; FRONT_L; FRONT_R; LINE2_L; LINE2_R; MIC2_L; MIC2_R; CENTER; LOW FREQU; SIDE-L; SIDE-R; SURR_L; SURR_R

### Library data of the parts
C253 C254 = C-TA-4.7uF-10V-20%-3216: Capacitor TA 4.7uF 10V 20% 3216; Tolerance: 20%; Type: TA; Value: 4.7uF
C255 C256 C259 C260 C263 C264 = C-X7R-100pF-50V-10%-0402: Capacitor Ceramic X7R 100pF 50V 10% 0402; Tolerance: 10%; Type: X7R; Value: 100pF
C257 C258 C261 C262 C265-C274 = C-TA-47uF-6.3V-20%-3216: Capacitor TA 47uF 6.3V 20% 3216; Tolerance: 20%; Type: TA; Value: 47uF
C285 = C-TA-100uF-10V-20%-3528: Capacitor TA 100uF 10V 20% 3528; Tolerance: 20%; Type: TA; Value: 100uF
C286 = C-X5R-10uF-10V-20%-0603: Capacitor Ceramic X5R 10uF 10V 20% 0603; Tolerance: 20%; Type: X5R; Value: 10uF
D12 D13 = D-Philips-BAT54A-Schottky: BAT54A Schottky Diode; Manufacturer Name: Philips; Manufacturer Part No.: BAT54A
IC28 = IC-Realtek-ALC898: HD_AUDIO_CODEC; Manufacturer Part No.: ALC898; Manufacturer Name: Realtek
L34-L39 L66 = L-120R@100MHz-2A-25%-0603: as L30 on sheet Audio_Codec; Rating: 2A; Value: 120R@100MHz
R210 R214 = R-5.1KR-63mW-1%-0402: Resistor 5.1 Kohm 63mW 1% 0402; Value: 5.1KR; Rating: 63mW; Tolerance: 1%
R211 R215 = R-10KR-63mW-1%-0402: Resistor 10 Kohm 63mW 1% 0402; Value: 10KR; Rating: 63mW; Tolerance: 1%
R212 R216 = R-20KR-63mW-1%-0402: Resistor 20 Kohm 63mW 1% 0402; Value: 20KR; Rating: 63mW; Tolerance: 1%
R213 R217 = R-39.2KR-63mW-1%-0402: Resistor 39.2 Kohm 63mW 1% 0402; Value: 39.2KR; Rating: 63mW; Tolerance: 1%
R220 R221 R228 R229 = R-1KR-63mW-5%-0402: Resistor 1 Kohm 63mW 5% 0402; Rating: 63mW; Tolerance: 5%; Value: 1K
R222 R223 R235-R237 R239 R244-R249 = R-75R-63mW-1%-0402: Resistor 75 ohm 63mW 1% 0402; Rating: 63mW; Tolerance: 1%; Value: 75R
R224 R225 R240-R243 R250-R255 = R-22KR-63mW-5%-0402: Resistor 22 Kohm 63mW 5% 0402; Value: 22KR; Rating: 63mW; Tolerance: 5%
R226 R227 = R-2.2KR-63mW-5%-0402: Resistor 2.2Kohm 63mW 5% 0402; Value: 2.2KR; Rating: 63mW; Tolerance: 5%
R230-R233 = R-4.7kR-63mW-5%-0402: Resistor 4.7 Kohm 63mW 5% 0402; Value: 4.7KR; Rating: 63mW; Tolerance: 5%
R234 = R-10KR-63mW-5%-0603: as R90 on sheet Analog_IOs; Rating: 63mW; Tolerance: 5%
R238 = R-0R-63mW-1%-0603: Resistor 0 ohm 63mW 1% 0603; Rating: 63mW; Tolerance: 1%; Value: 0R
X27 = CON-Foxconn-JA3333L-D11P-4F: as X26 on sheet Analogue_Audio; Manufacturer Name: Foxconn; Manufacturer Part No.: JA3333L-D11P-4F
X41 X42 = CON-Samtec-TSW-105-07-G-D: Header Male, 2x5 Pins, 2.54mm pitch; Manufacturer Name: Samtec; No. of. ways: 2x5; Pitch: 2.54mm; Manufacturer Part No.: TSW-105-07-G-D